# Altium project HU_revB.PrjPcb (part 1 of 4)
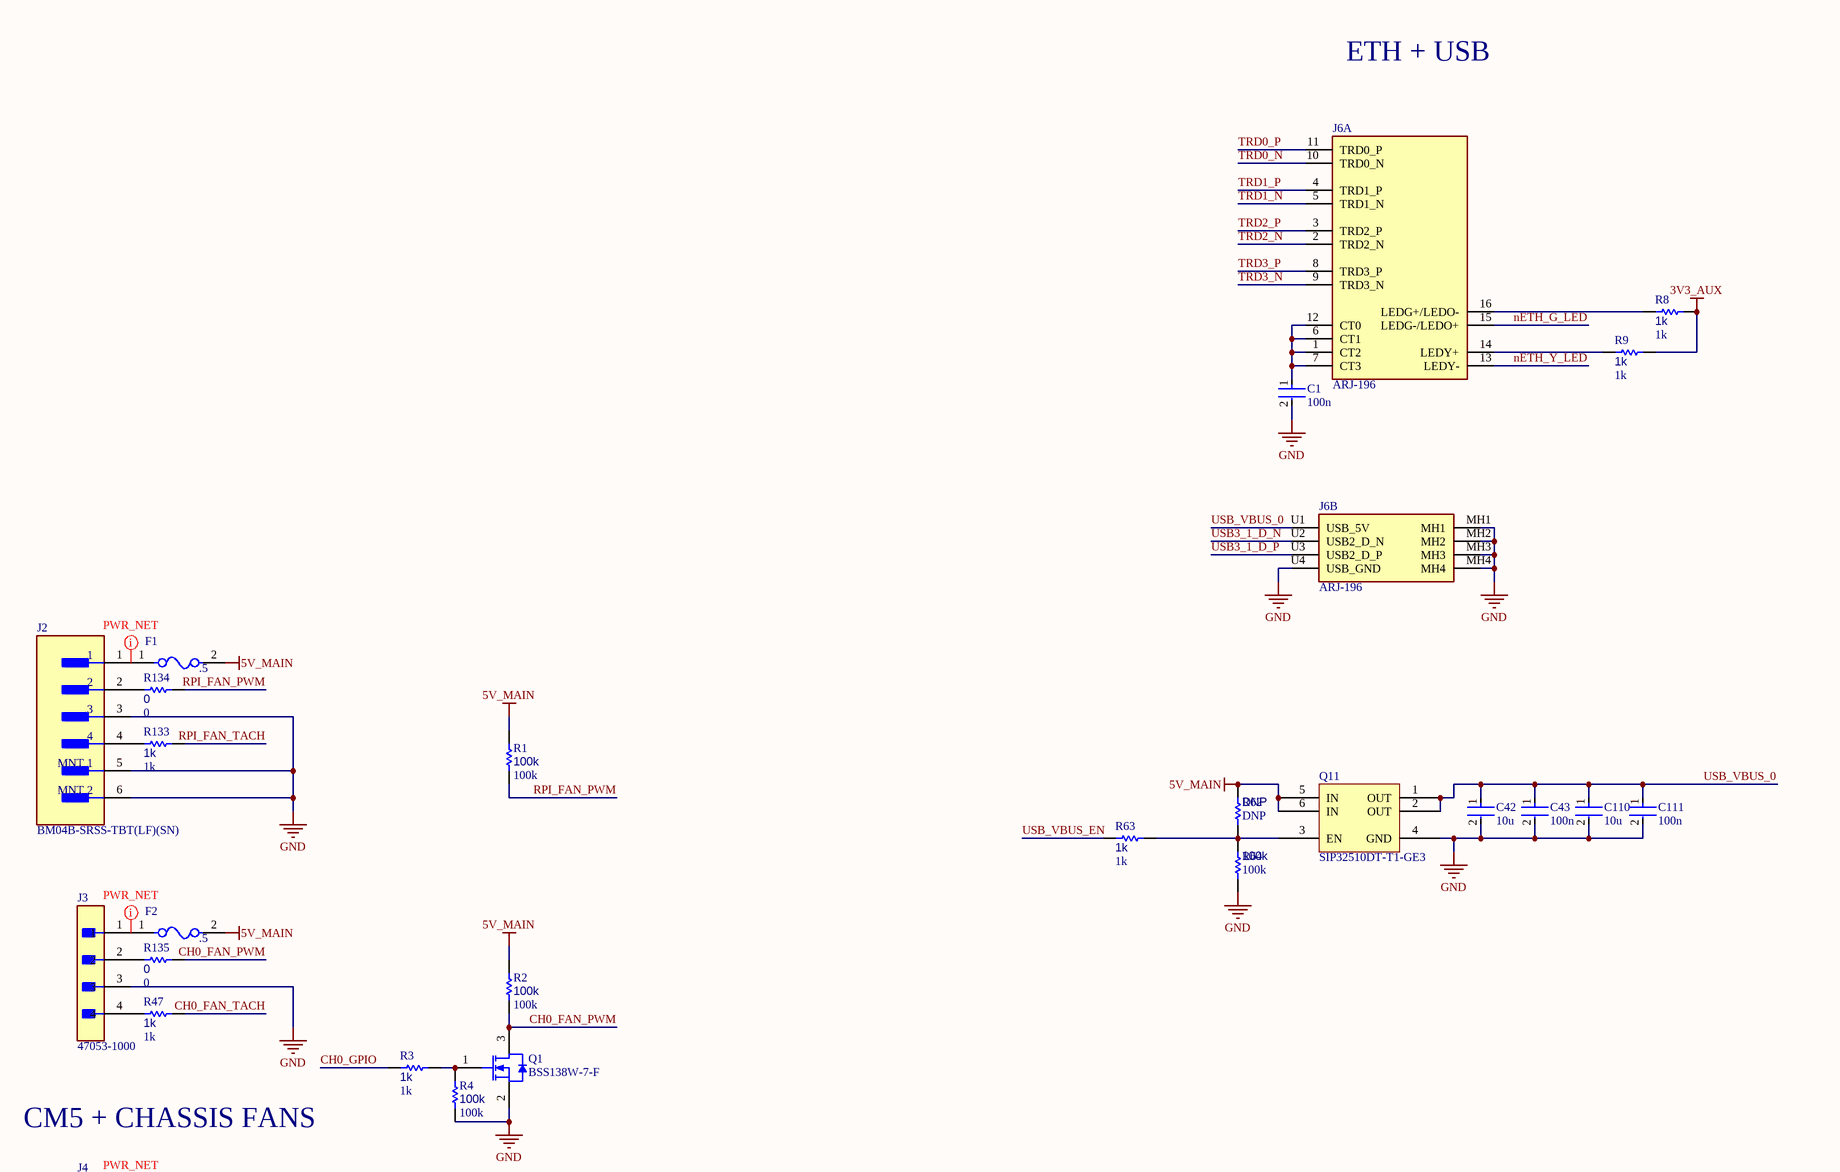
[diagram p0: HU_revB.SchDoc, top right]
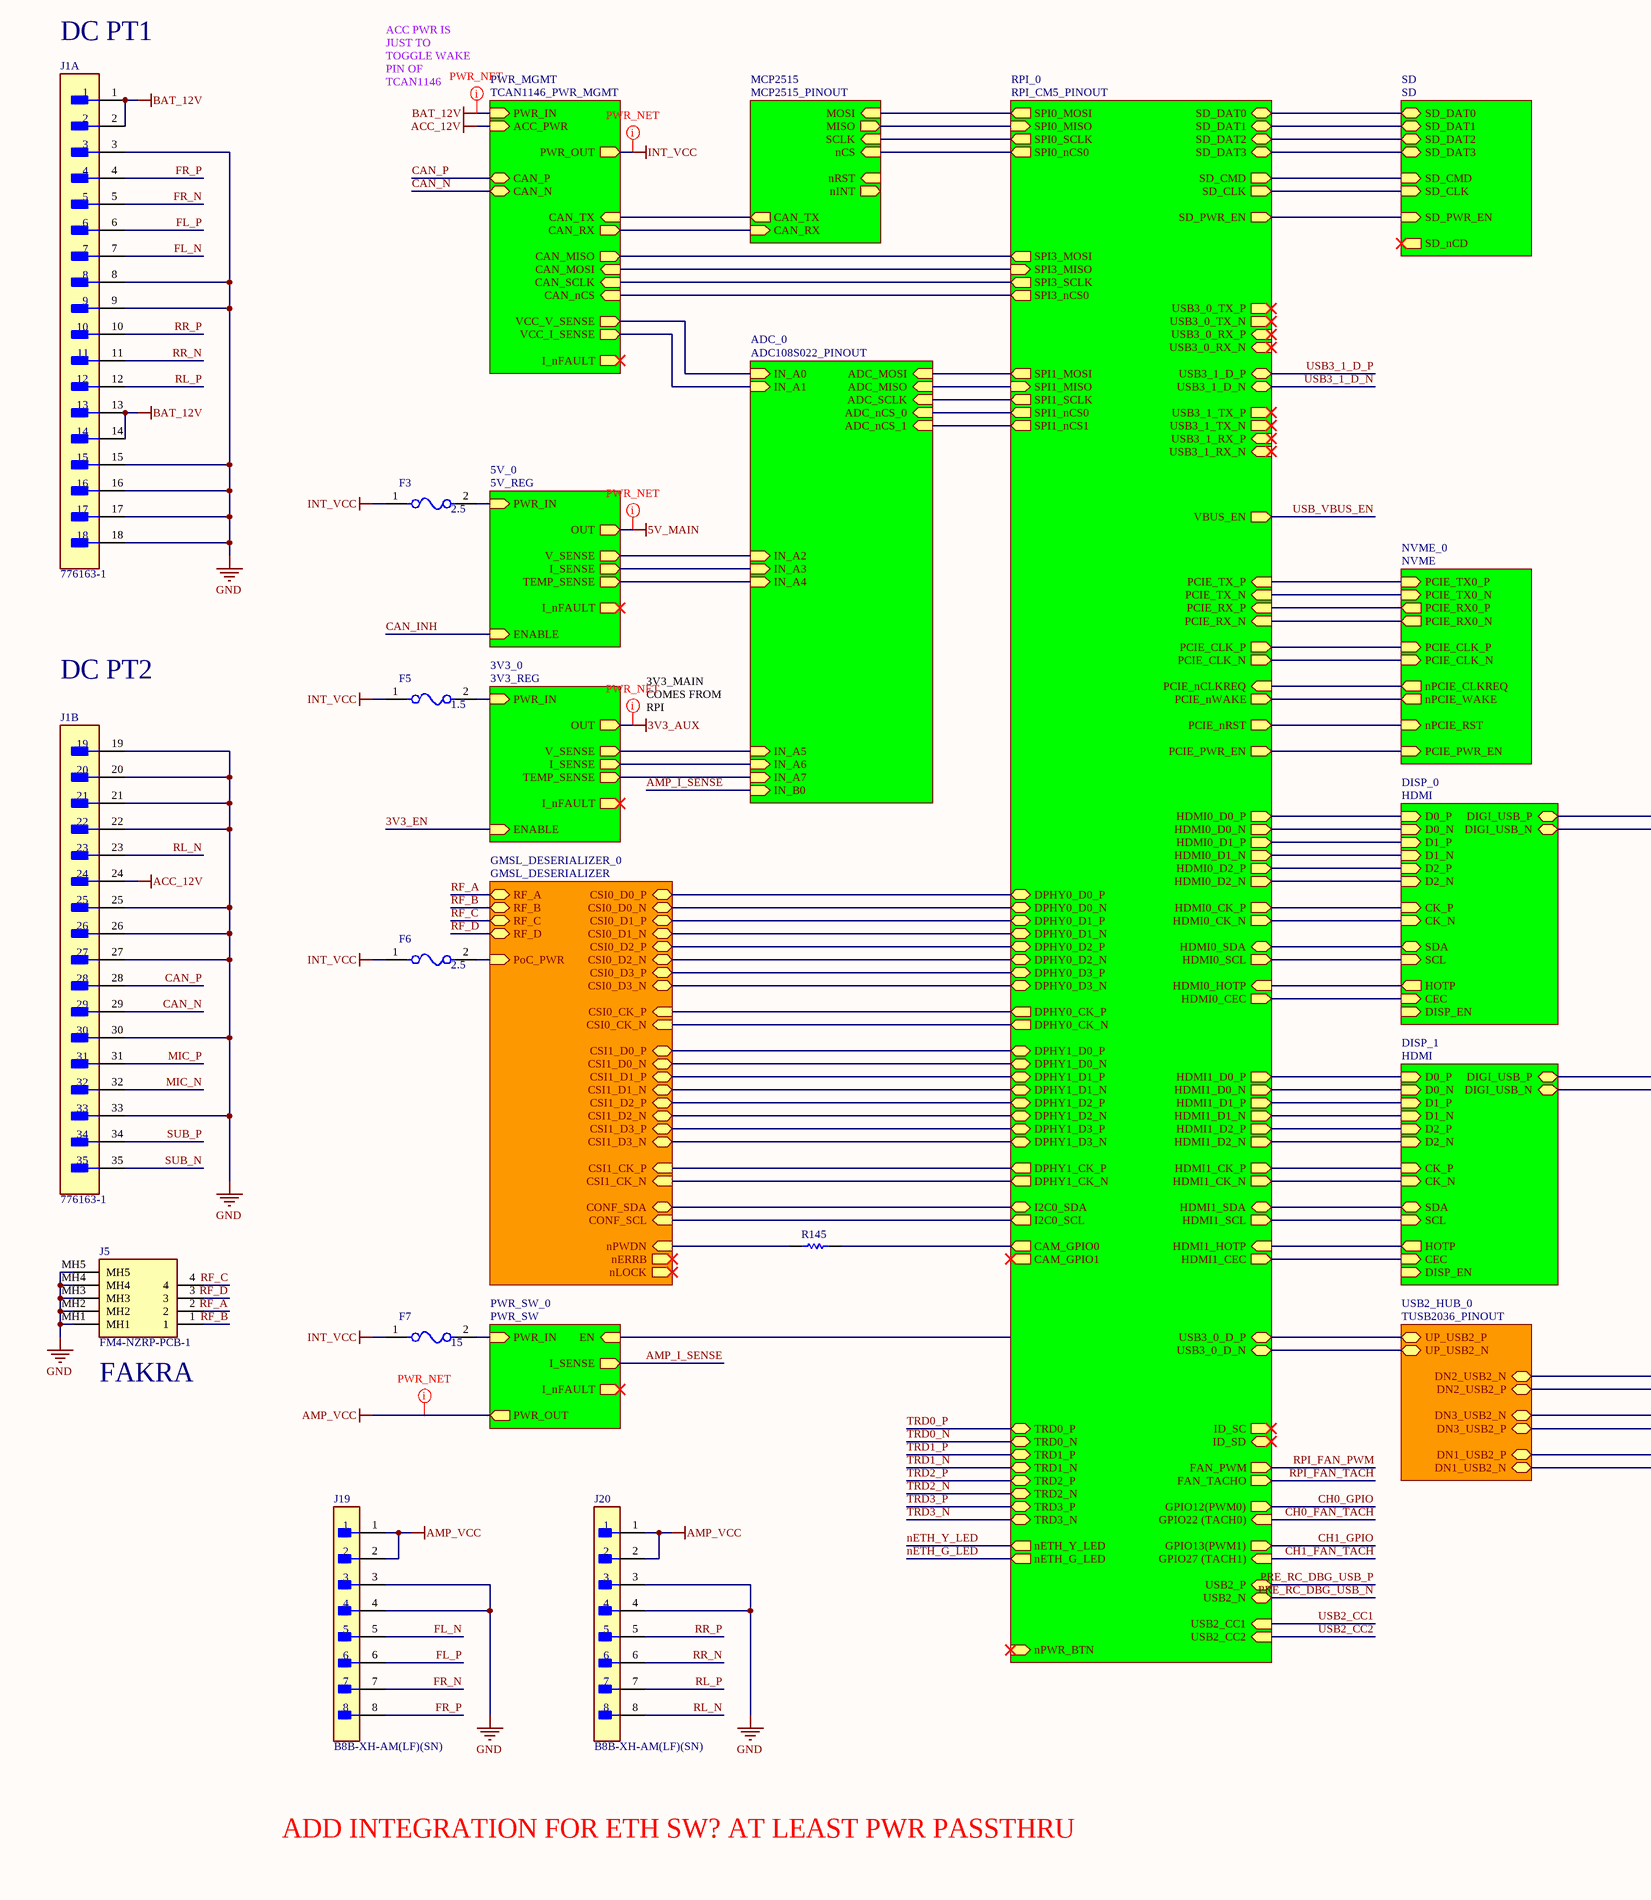
[diagram p1: HU_revB.SchDoc, bottom left]
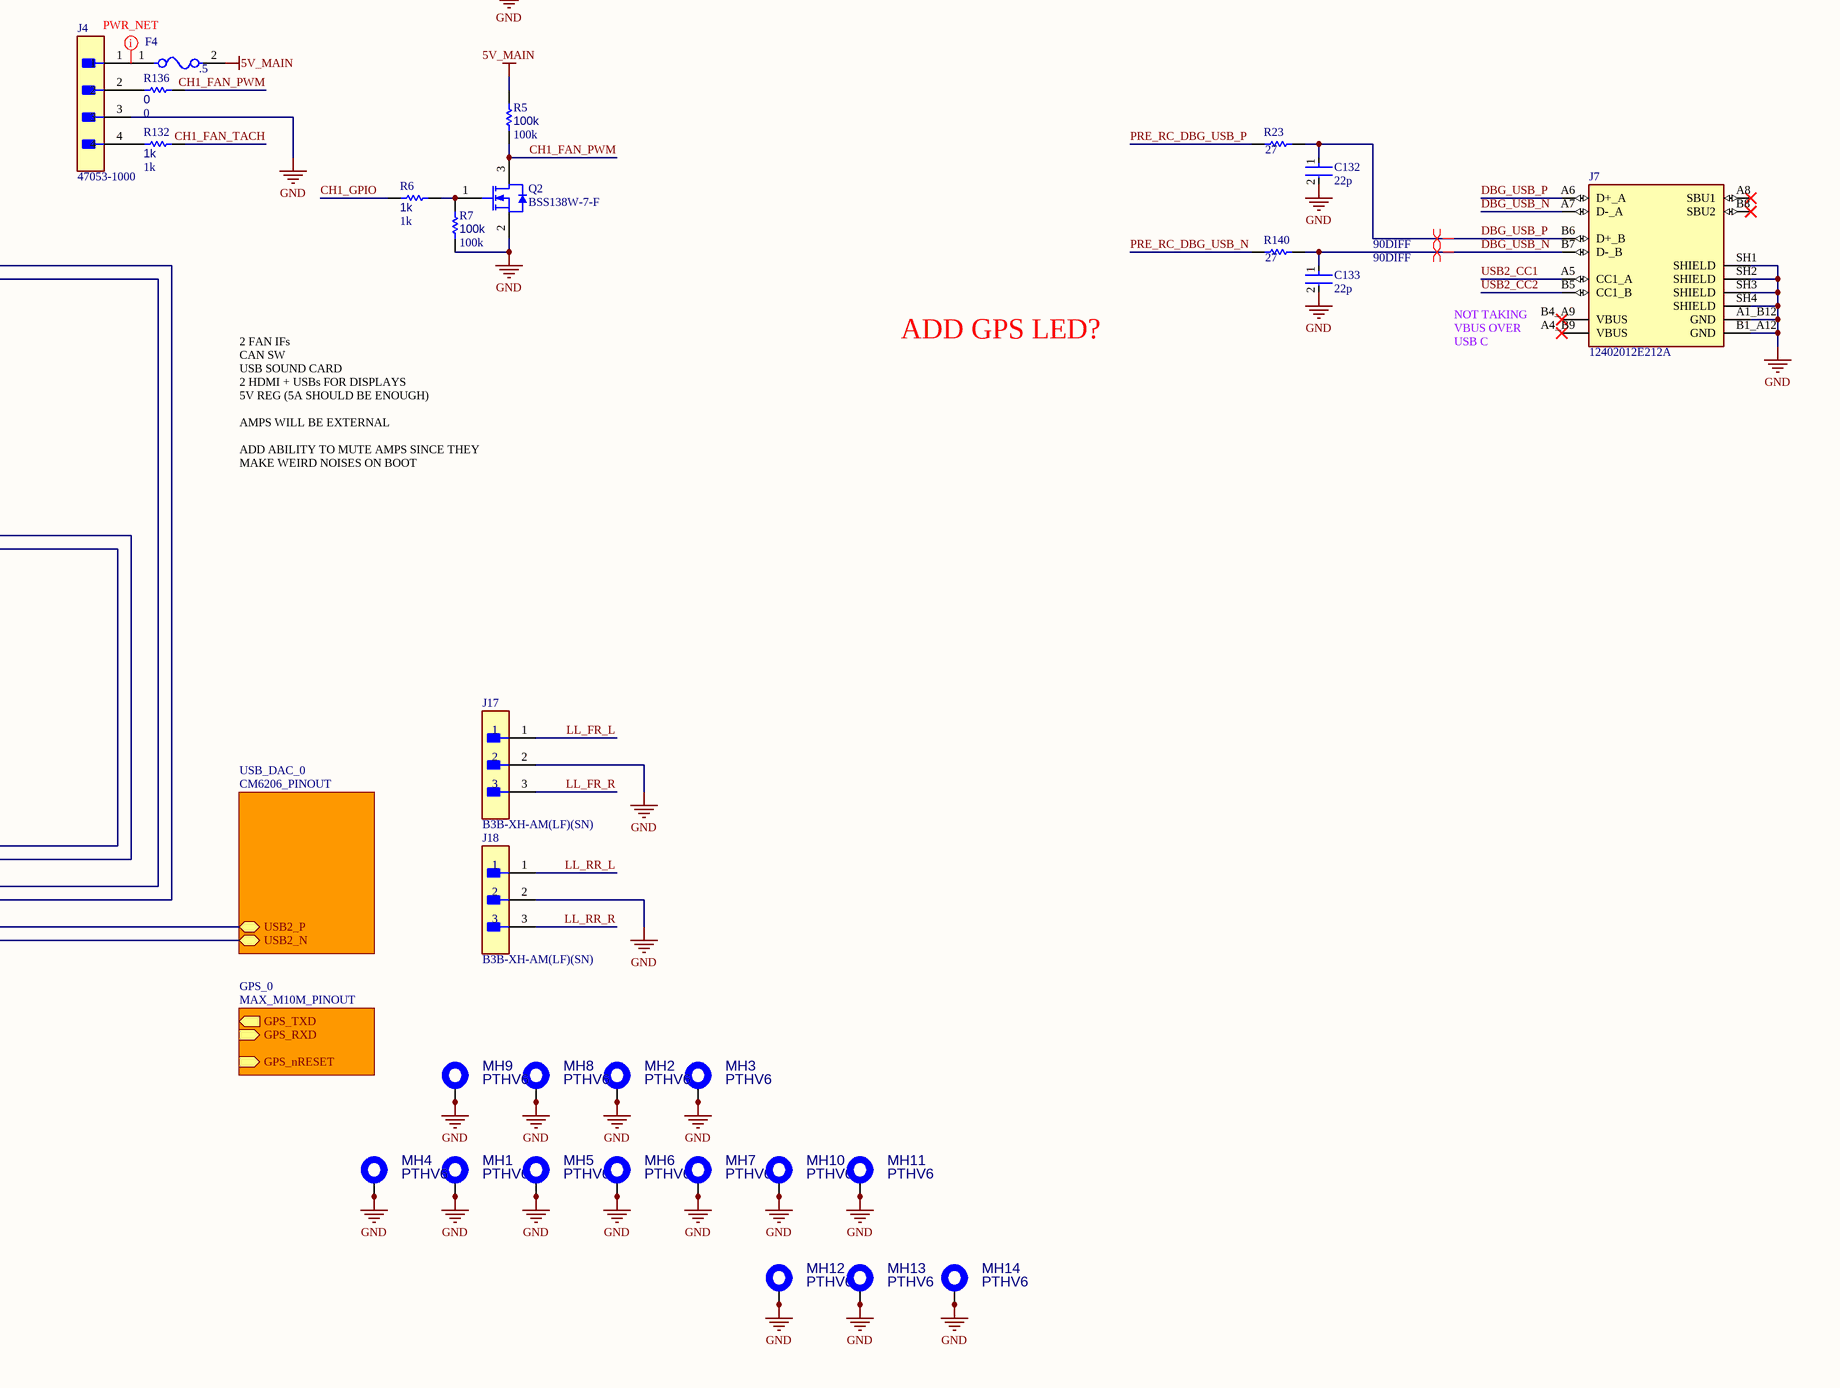
[diagram p2: HU_revB.SchDoc, bottom right]
16 sheets, 422 parts. Net scope: hierarchical (ports join the sheet entries above them; power ports are global).
Board file: HU_revB.PcbDoc
Sheets:
  HU_revB.SchDoc
    PWR_MGMT = TCAN1146_PWR_MGMT.SchDoc
    USB_DAC_0 = CM6206_PINOUT.SchDoc
    RPI_0 = RPI_CM5_PINOUT.SchDoc
    5V_0 = 5V_REG.SchDoc
    NVME_0 = NVME.SchDoc
    MCP2515 = MCP2515_PINOUT.SchDoc
    SD = SD.SchDoc
    DISP_0 = HDMI.SchDoc
    USB2_HUB_0 = TUSB2036_PINOUT.SchDoc
    DISP_1 = HDMI.SchDoc
    3V3_0 = 3V3_REG.SchDoc
    GMSL_DESERIALIZER_0 = GMSL_DESERIALIZER.SchDoc
    PWR_SW_0 = PWR_SW.SchDoc
    GPS_0 = MAX_M10M_PINOUT.SchDoc
  USB.SchDoc
  TS3USB221A_PINOUT.SchDoc

## Sheet HU_revB.SchDoc
size D; SheetNumber: 1; SheetTotal: 17

### Parts
(Parts that share a designator on the sheet are numbered #1, #2 ... from top to bottom, then left to right.)
C1  100n  [FP-0402-L_1_0_0_05-W_0_5-IPC_A]
C42#1  10u  [FP-0402-L_1_0_0_05-W_0_5-IPC_A]
C43#1  100n  [FP-0402-L_1_0_0_05-W_0_5-IPC_A]
C110  10u  [FP-0402-L_1_0_0_05-W_0_5-IPC_A]
C111  100n  [FP-0402-L_1_0_0_05-W_0_5-IPC_A]
C132  22p  [FP-0402-L_1_0_0_05-W_0_5-IPC_A]
C133  22p  [FP-0402-L_1_0_0_05-W_0_5-IPC_A]
F1  .5  [FP-0685T-MFG]
F2  .5  [FP-0685T-MFG]
F3  2.5  [FP-0685T-MFG]
F4  .5  [FP-0685T-MFG]
F5  1.5  [FP-0685T-MFG]
F6  2.5  [FP-0685T-MFG]
F7  15  [FP-0685T-MFG]
J1  776163-1  [FP-776163-1-MFG]  (parts A,B of 2)
J2  BM04B-SRSS-TBT(LF)(SN)  [FP-BM04B-SRSS-TBT_LF_SN-MFG]
J3  47053-1000  [FP-470531000-MFG]
J4  47053-1000  [FP-470531000-MFG]
J5  FM4-NZRP-PCB-1  [FM4-NZRP-PCB-1-Footprint-1]
J6  ARJ-196  [ARJ-196-Footprint-1]  (parts A,B of 2)
J7  12402012E212A  [12402012E212A-Footprint-1]
J17  B3B-XH-AM(LF)(SN)  [FP-B3B-XH-AM_LF_SN-MFG]
J18  B3B-XH-AM(LF)(SN)  [FP-B3B-XH-AM_LF_SN-MFG]
J19  B8B-XH-AM(LF)(SN)  [FP-B8B-XH-AM_LF_SN-MFG]
J20  B8B-XH-AM(LF)(SN)  [FP-B8B-XH-AM_LF_SN-MFG]
MH1  PTHV6  [PTHV6 M2]  (net tie, no BOM)
MH2  PTHV6  [PTHV6 M2]  (net tie, no BOM)
MH3  PTHV6  [PTHV6 M2]  (net tie, no BOM)
MH4  PTHV6  [PTHV6 M2]  (net tie, no BOM)
MH5  PTHV6  [PTHV6 M2]  (net tie, no BOM)
MH6  PTHV6  [PTHV6 M2]  (net tie, no BOM)
MH7  PTHV6  [PTHV6 M2]  (net tie, no BOM)
MH8  PTHV6  [PTHV6 M2]  (net tie, no BOM)
MH9  PTHV6  [PTHV6 M2]  (net tie, no BOM)
MH10  PTHV6  [PTHV6 M2]  (net tie, no BOM)
MH11  PTHV6  [PTHV6 M2]  (net tie, no BOM)
MH12  PTHV6  [PTHV6 M2]  (net tie, no BOM)
MH13  PTHV6  [PTHV6 M2]  (net tie, no BOM)
MH14  PTHV6  [PTHV6 M2]  (net tie, no BOM)
Q1  BSS138W-7-F  [DIOD-SOT323-3_V]
Q2  BSS138W-7-F  [DIOD-SOT323-3_V]
Q11#1  SIP32510DT-T1-GE3  [SOT95P284X110-6N]
R1  100k  [R0603B]
R2  100k  [R0603B]
R3  1k  [R0603B]
R4  100k  [R0603B]
R5  100k  [R0603B]
R6  1k  [R0603B]
R7  100k  [R0603B]
R8  1k  [R0603B]
R9  1k  [R0603B]
R23  27  [R0603B]
R47  1k  [R0603B]
R62#1  DNP  [R0603B]
R63#1  1k  [R0603B]
R64#1  100k  [R0603B]
R132  1k  [R0603B]
R133  1k  [R0603B]
R134  0  [R0603B]
R135  0  [R0603B]
R136  0  [R0603B]
R140  27  [R0603B]
R145  DNP  [RESC1005X40X25ML05T05]  (value not drawn)

### Sub-sheets
3V3_0 = 3V3_REG: PWR_IN (in), OUT (out), V_SENSE (out), I_SENSE (out), TEMP_SENSE (out), I_nFAULT (out), ENABLE (in)
5V_0 = 5V_REG: PWR_IN (in), OUT (out), V_SENSE (out), I_SENSE (out), TEMP_SENSE (out), I_nFAULT (out), ENABLE (in)
ADC_0 = ADC108S022_PINOUT (file not in this document): IN_A0 (in), IN_A1 (in), IN_A2 (in), IN_A3 (in), IN_A4 (in), IN_A5 (in), IN_A6 (in), IN_A7 (in), IN_B0 (in), ADC_MOSI (in), ADC_MISO (in), ADC_SCLK (in), ADC_nCS_0 (in), ADC_nCS_1 (in)
DISP_0 = HDMI: D0_N (in), D0_P (in), D2_P (in), D2_N (in), D1_P (in), D1_N (in), CK_P (in), CK_N (in), CEC (in), HOTP (out), SCL (in), SDA (bidir), DISP_EN (in), DIGI_USB_P (bidir), DIGI_USB_N (bidir)
DISP_1 = HDMI: D0_N (in), D0_P (in), D2_P (in), D2_N (in), D1_P (in), D1_N (in), CK_P (in), CK_N (in), CEC (in), HOTP (out), SCL (in), SDA (bidir), DISP_EN (in), DIGI_USB_P (bidir), DIGI_USB_N (bidir)
GMSL_DESERIALIZER_0 = GMSL_DESERIALIZER: CSI0_D0_P (bidir), CSI0_D0_N (bidir), CSI0_D1_P (bidir), CSI0_D1_N (bidir), CSI0_D2_P (bidir), CSI0_D2_N (bidir), CSI0_D3_P (bidir), CSI0_D3_N (bidir), CSI0_CK_P (in), CSI0_CK_N (in), CSI1_D0_P (bidir), CSI1_D0_N (bidir), CSI1_D1_P (bidir), CSI1_D1_N (bidir), CSI1_D2_P (bidir), CSI1_D2_N (bidir), CSI1_D3_P (bidir), CSI1_D3_N (bidir), CSI1_CK_P (in), CSI1_CK_N (in), RF_B (bidir), RF_A (bidir), RF_C (bidir), RF_D (bidir), CONF_SDA (bidir), CONF_SCL (in), nPWDN (in), PoC_PWR (in), nERRB (out), nLOCK (out)
GPS_0 = MAX_M10M_PINOUT: GPS_TXD (out), GPS_RXD (in), GPS_nRESET (in)
MCP2515 = MCP2515_PINOUT: MOSI (in), nCS (in), SCLK (in), MISO (out), nINT (out), nRST (in), CAN_RX (in), CAN_TX (out)
NVME_0 = NVME: nPCIE_RST (in), nPCIE_CLKREQ (out), nPCIE_WAKE (out), PCIE_PWR_EN (in), PCIE_TX0_N (in), PCIE_TX0_P (in), PCIE_RX0_N (out), PCIE_RX0_P (out), PCIE_CLK_N (in), PCIE_CLK_P (in)
PWR_MGMT = TCAN1146_PWR_MGMT: PWR_IN (in), PWR_OUT (out), CAN_P (bidir), CAN_N (bidir), CAN_TX (in), CAN_RX (out), CAN_SCLK (in), CAN_MISO (out), CAN_MOSI (in), CAN_nCS (in), VCC_V_SENSE (out), VCC_I_SENSE (out), I_nFAULT (out), ACC_PWR (in)
PWR_SW_0 = PWR_SW: PWR_IN (in), PWR_OUT (out), EN (in), I_SENSE (out), I_nFAULT (out)
RPI_0 = RPI_CM5_PINOUT: SD_CLK (out), SD_CMD (out), SD_DAT3 (bidir), SD_DAT0 (bidir), SD_DAT1 (bidir), SD_DAT2 (bidir), SD_PWR_EN (out), USB3_0_D_P (bidir), USB3_0_D_N (bidir), USB3_1_D_P (bidir), USB3_1_D_N (bidir), USB3_0_RX_N (in), USB3_0_RX_P (in), USB3_0_TX_N (out), USB3_0_TX_P (out), USB3_1_RX_N (in), USB3_1_RX_P (in), USB3_1_TX_N (out), USB3_1_TX_P (out), VBUS_EN (out), PCIE_nCLKREQ (in), PCIE_nWAKE (out), PCIE_PWR_EN (out), PCIE_CLK_P (out), PCIE_nRST (out), PCIE_CLK_N (out), PCIE_RX_P (in), PCIE_RX_N (in), PCIE_TX_P (in), PCIE_TX_N (in), HDMI1_HOTP (in), HDMI1_SDA (bidir), HDMI1_D2_P (out), HDMI1_D2_N (out), HDMI1_SCL (out), HDMI1_CEC (out), HDMI0_CEC (out), HDMI1_D1_P (out), HDMI1_D1_N (out), HDMI0_HOTP (in), HDMI1_D0_P (out), HDMI1_D0_N (out), HDMI1_CK_P (out), HDMI1_CK_N (out), HDMI0_D2_P (out), HDMI0_D2_N (out), HDMI0_D1_P (out), HDMI0_D1_N (out), HDMI0_D0_P (out), HDMI0_D0_N (out), HDMI0_CK_P (out), HDMI0_CK_N (out), HDMI0_SCL (out), HDMI0_SDA (bidir), USB2_N (bidir), USB2_P (bidir), DPHY0_D0_N (bidir), DPHY0_D0_P (bidir), DPHY0_D1_N (bidir), DPHY0_D1_P (bidir), DPHY0_D2_N (bidir), DPHY0_D2_P (bidir), DPHY0_D3_N (bidir), DPHY0_D3_P (bidir), DPHY0_CK_N (out), DPHY0_CK_P (out), DPHY1_D0_N (bidir), DPHY1_D0_P (bidir), DPHY1_D1_N (bidir), DPHY1_D1_P (bidir), DPHY1_D3_N (bidir), DPHY1_D2_N (bidir), DPHY1_D3_P (bidir), DPHY1_D2_P (bidir), DPHY1_CK_N (out), DPHY1_CK_P (out), TRD3_P (bidir), TRD1_P (bidir), TRD3_N (bidir), TRD1_N (bidir), TRD2_N (bidir), TRD0_N (bidir), TRD2_P (bidir), TRD0_P (bidir), nETH_Y_LED (out), nETH_G_LED (out), FAN_TACHO (out), FAN_PWM (out), SPI0_SCLK (out), SPI0_MISO (in), SPI0_nCS0 (out), SPI0_MOSI (out), SPI3_MOSI (out), SPI3_MISO (in), SPI3_SCLK (out), SPI3_nCS0 (out), SPI1_MISO (in), SPI1_MOSI (out), SPI1_nCS0 (out), SPI1_nCS1 (out), SPI1_SCLK (out), I2C0_SCL (out), I2C0_SDA (bidir), CAM_GPIO0 (out), CAM_GPIO1 (out), nPWR_BTN (in), GPIO12(PWM0) (out), GPIO13(PWM1) (out), GPIO22 (TACH0) (in), GPIO27 (TACH1) (in), ID_SC (out), ID_SD (bidir), USB2_CC1 (in), USB2_CC2 (in)
SD = SD: SD_DAT0 (bidir), SD_DAT1 (bidir), SD_DAT2 (bidir), SD_DAT3 (bidir), SD_CMD (in), SD_CLK (in), SD_PWR_EN (in), SD_nCD (out)
USB2_HUB_0 = TUSB2036_PINOUT: UP_USB2_N (bidir), UP_USB2_P (bidir), DN1_USB2_N (bidir), DN1_USB2_P (bidir), DN2_USB2_N (bidir), DN2_USB2_P (bidir), DN3_USB2_N (bidir), DN3_USB2_P (bidir)
USB_DAC_0 = CM6206_PINOUT: USB2_P (bidir), USB2_N (bidir)

### Nets
3V3_AUX: R8.1 R9.1 ; sheet 3V3_0/OUT
5V_MAIN: F1.2 F2.2 F4.2 Q11#1.5(IN) Q11#1.6(IN) R1.1 R2.1 R5.1 R62#1.2 ; sheet 5V_0/OUT
ACC_12V: J1.24 ; sheet PWR_MGMT/ACC_PWR
AMP_VCC: J19.1 J19.2 J20.1 J20.2 ; sheet PWR_SW_0/PWR_OUT
BAT_12V: J1.1 J1.2 J1.13 J1.14 ; sheet PWR_MGMT/PWR_IN
GND: C1.2 C42#1.2 C43#1.2 C110.2 C111.2 C132.2 C133.2 J1.3 J1.8 J1.9 J1.15 J1.16 J1.17 J1.18 J1.19 J1.20 J1.21 J1.22 J1.25 J1.26 J1.27 J1.30 J1.33 J2.3 J2.5(MNT_1) J2.6(MNT_2) J3.3 J4.3 J5.MH1 J5.MH2 J5.MH3 J5.MH4 J5.MH5 J6.MH1 J6.MH2 J6.MH3 J6.MH4 J6.U4(USB_GND) J7.A1_B12(GND) J7.B1_A12(GND) J7.SH1(SHIELD) J7.SH2(SHIELD) J7.SH3(SHIELD) J7.SH4(SHIELD) J17.2 J18.2 J19.3 J19.4 J20.3 J20.4 MH1.1(MH) MH1.2(V1) MH1.3(V2) MH1.4(V3) MH1.5(V4) MH1.6(V5) MH1.7(V6) MH2.1(MH) MH2.2(V1) MH2.3(V2) MH2.4(V3) MH2.5(V4) MH2.6(V5) MH2.7(V6) MH3.1(MH) MH3.2(V1) MH3.3(V2) MH3.4(V3) MH3.5(V4) MH3.6(V5) MH3.7(V6) MH4.1(MH) MH4.2(V1) MH4.3(V2) MH4.4(V3) MH4.5(V4) MH4.6(V5) MH4.7(V6) MH5.1(MH) MH5.2(V1) MH5.3(V2) MH5.4(V3) MH5.5(V4) MH5.6(V5) MH5.7(V6) MH6.1(MH) MH6.2(V1) MH6.3(V2) MH6.4(V3) MH6.5(V4) MH6.6(V5) MH6.7(V6) MH7.1(MH) MH7.2(V1) MH7.3(V2) MH7.4(V3) MH7.5(V4) MH7.6(V5) MH7.7(V6) MH8.1(MH) MH8.2(V1) MH8.3(V2) MH8.4(V3) MH8.5(V4) MH8.6(V5) MH8.7(V6) MH9.1(MH) MH9.2(V1) MH9.3(V2) MH9.4(V3) MH9.5(V4) MH9.6(V5) MH9.7(V6) MH10.1(MH) MH10.2(V1) MH10.3(V2) MH10.4(V3) MH10.5(V4) MH10.6(V5) MH10.7(V6) MH11.1(MH) MH11.2(V1) MH11.3(V2) MH11.4(V3) MH11.5(V4) MH11.6(V5) MH11.7(V6) MH12.1(MH) MH12.2(V1) MH12.3(V2) MH12.4(V3) MH12.5(V4) MH12.6(V5) MH12.7(V6) MH13.1(MH) MH13.2(V1) MH13.3(V2) MH13.4(V3) MH13.5(V4) MH13.6(V5) MH13.7(V6) MH14.1(MH) MH14.2(V1) MH14.3(V2) MH14.4(V3) MH14.5(V4) MH14.6(V5) MH14.7(V6) Q1.2(S) Q2.2(S) Q11#1.4(GND) R4.2 R7.2 R64#1.1
INT_VCC: F3.1 F5.1 F6.1 F7.1 ; sheet PWR_MGMT/PWR_OUT  [project net PWR_OUT]
AMP_I_SENSE: sheet ADC_0/IN_B0, sheet PWR_SW_0/I_SENSE
CAM_GPIO0: R145.1 ; sheet RPI_0/CAM_GPIO0
CAN_N: J1.29 ; sheet PWR_MGMT/CAN_N
CAN_P: J1.28 ; sheet PWR_MGMT/CAN_P
CH0_FAN_PWM: Q1.3(D) R2.2 R135.2
CH0_FAN_TACH: R47.2 ; sheet RPI_0/GPIO22 (TACH0)
CH0_GPIO: R3.1 ; sheet RPI_0/GPIO12(PWM0)
CH1_FAN_PWM: Q2.3(D) R5.2 R136.2
CH1_FAN_TACH: R132.2 ; sheet RPI_0/GPIO27 (TACH1)
CH1_GPIO: R6.1 ; sheet RPI_0/GPIO13(PWM1)
CONF_SCL: sheet RPI_0/I2C0_SCL, sheet GMSL_DESERIALIZER_0/CONF_SCL
CONF_SDA: sheet RPI_0/I2C0_SDA, sheet GMSL_DESERIALIZER_0/CONF_SDA
DBG_USB_N: C133.1 J7.A7(D-_A) J7.B7(D-_B) R140.1
DBG_USB_P: C132.1 J7.A6(D+_A) J7.B6(D+_B) R23.1
DIGI_USB_N: sheet DISP_0/DIGI_USB_N, sheet USB2_HUB_0/DN3_USB2_N
DIGI_USB_N: sheet USB2_HUB_0/DN2_USB2_N, sheet DISP_1/DIGI_USB_N  [a separate net that carries the same name]
DIGI_USB_P: sheet DISP_0/DIGI_USB_P, sheet USB2_HUB_0/DN3_USB2_P
DIGI_USB_P: sheet USB2_HUB_0/DN2_USB2_P, sheet DISP_1/DIGI_USB_P  [a separate net that carries the same name]
DPHY0_CK_N: sheet RPI_0/DPHY0_CK_N, sheet GMSL_DESERIALIZER_0/CSI0_CK_N
DPHY0_CK_P: sheet RPI_0/DPHY0_CK_P, sheet GMSL_DESERIALIZER_0/CSI0_CK_P
DPHY0_D0_N: sheet RPI_0/DPHY0_D0_N, sheet GMSL_DESERIALIZER_0/CSI0_D0_N
DPHY0_D0_P: sheet RPI_0/DPHY0_D0_P, sheet GMSL_DESERIALIZER_0/CSI0_D0_P
DPHY0_D1_N: sheet RPI_0/DPHY0_D1_N, sheet GMSL_DESERIALIZER_0/CSI0_D1_N
DPHY0_D1_P: sheet RPI_0/DPHY0_D1_P, sheet GMSL_DESERIALIZER_0/CSI0_D1_P
DPHY0_D2_N: sheet RPI_0/DPHY0_D2_N, sheet GMSL_DESERIALIZER_0/CSI0_D2_N
DPHY0_D2_P: sheet RPI_0/DPHY0_D2_P, sheet GMSL_DESERIALIZER_0/CSI0_D2_P
DPHY0_D3_N: sheet RPI_0/DPHY0_D3_N, sheet GMSL_DESERIALIZER_0/CSI0_D3_N
DPHY0_D3_P: sheet RPI_0/DPHY0_D3_P, sheet GMSL_DESERIALIZER_0/CSI0_D3_P
DPHY1_CK_N: sheet RPI_0/DPHY1_CK_N, sheet GMSL_DESERIALIZER_0/CSI1_CK_N
DPHY1_CK_P: sheet RPI_0/DPHY1_CK_P, sheet GMSL_DESERIALIZER_0/CSI1_CK_P
DPHY1_D0_N: sheet RPI_0/DPHY1_D0_N, sheet GMSL_DESERIALIZER_0/CSI1_D0_N
DPHY1_D0_P: sheet RPI_0/DPHY1_D0_P, sheet GMSL_DESERIALIZER_0/CSI1_D0_P
DPHY1_D1_N: sheet RPI_0/DPHY1_D1_N, sheet GMSL_DESERIALIZER_0/CSI1_D1_N
DPHY1_D1_P: sheet RPI_0/DPHY1_D1_P, sheet GMSL_DESERIALIZER_0/CSI1_D1_P
DPHY1_D2_N: sheet RPI_0/DPHY1_D2_N, sheet GMSL_DESERIALIZER_0/CSI1_D2_N
DPHY1_D2_P: sheet RPI_0/DPHY1_D2_P, sheet GMSL_DESERIALIZER_0/CSI1_D2_P
DPHY1_D3_N: sheet RPI_0/DPHY1_D3_N, sheet GMSL_DESERIALIZER_0/CSI1_D3_N
DPHY1_D3_P: sheet RPI_0/DPHY1_D3_P, sheet GMSL_DESERIALIZER_0/CSI1_D3_P
FL_N: J1.7 J19.5
FL_P: J1.6 J19.6
FR_N: J1.5 J19.7
FR_P: J1.4 J19.8
HDMI0_CEC: sheet RPI_0/HDMI0_CEC, sheet DISP_0/CEC
HDMI0_CK_N: sheet RPI_0/HDMI0_CK_N, sheet DISP_0/CK_N
HDMI0_CK_P: sheet RPI_0/HDMI0_CK_P, sheet DISP_0/CK_P
HDMI0_D0_N: sheet RPI_0/HDMI0_D0_N, sheet DISP_0/D0_N
HDMI0_D0_P: sheet RPI_0/HDMI0_D0_P, sheet DISP_0/D0_P
HDMI0_D1_N: sheet RPI_0/HDMI0_D1_N, sheet DISP_0/D1_N
HDMI0_D1_P: sheet RPI_0/HDMI0_D1_P, sheet DISP_0/D1_P
HDMI0_D2_N: sheet RPI_0/HDMI0_D2_N, sheet DISP_0/D2_N
HDMI0_D2_P: sheet RPI_0/HDMI0_D2_P, sheet DISP_0/D2_P
HDMI0_HOTP: sheet RPI_0/HDMI0_HOTP, sheet DISP_0/HOTP
HDMI0_SCL: sheet RPI_0/HDMI0_SCL, sheet DISP_0/SCL
HDMI0_SDA: sheet RPI_0/HDMI0_SDA, sheet DISP_0/SDA
HDMI1_CEC: sheet RPI_0/HDMI1_CEC, sheet DISP_1/CEC
HDMI1_CK_N: sheet RPI_0/HDMI1_CK_N, sheet DISP_1/CK_N
HDMI1_CK_P: sheet RPI_0/HDMI1_CK_P, sheet DISP_1/CK_P
HDMI1_D0_N: sheet RPI_0/HDMI1_D0_N, sheet DISP_1/D0_N
HDMI1_D0_P: sheet RPI_0/HDMI1_D0_P, sheet DISP_1/D0_P
HDMI1_D1_N: sheet RPI_0/HDMI1_D1_N, sheet DISP_1/D1_N
HDMI1_D1_P: sheet RPI_0/HDMI1_D1_P, sheet DISP_1/D1_P
HDMI1_D2_N: sheet RPI_0/HDMI1_D2_N, sheet DISP_1/D2_N
HDMI1_D2_P: sheet RPI_0/HDMI1_D2_P, sheet DISP_1/D2_P
HDMI1_HOTP: sheet RPI_0/HDMI1_HOTP, sheet DISP_1/HOTP
HDMI1_SCL: sheet RPI_0/HDMI1_SCL, sheet DISP_1/SCL
HDMI1_SDA: sheet RPI_0/HDMI1_SDA, sheet DISP_1/SDA
LL_FR_L: J17.1
LL_FR_R: J17.3
LL_RR_L: J18.1
LL_RR_R: J18.3
MIC_N: J1.32
MIC_P: J1.31
nETH_G_LED: J6.15(LEDG-/LEDO+) ; sheet RPI_0/nETH_G_LED
nETH_Y_LED: J6.13(LEDY-) ; sheet RPI_0/nETH_Y_LED
nPWDN: R145.2 ; sheet GMSL_DESERIALIZER_0/nPWDN
PCIE_CLK_N: sheet RPI_0/PCIE_CLK_N, sheet NVME_0/PCIE_CLK_N
PCIE_CLK_P: sheet RPI_0/PCIE_CLK_P, sheet NVME_0/PCIE_CLK_P
PCIE_nCLKREQ: sheet RPI_0/PCIE_nCLKREQ, sheet NVME_0/nPCIE_CLKREQ
PCIE_nRST: sheet RPI_0/PCIE_nRST, sheet NVME_0/nPCIE_RST
PCIE_nWAKE: sheet RPI_0/PCIE_nWAKE, sheet NVME_0/nPCIE_WAKE
PCIE_PWR_EN: sheet RPI_0/PCIE_PWR_EN, sheet NVME_0/PCIE_PWR_EN
PCIE_RX0_N: sheet RPI_0/PCIE_RX_N, sheet NVME_0/PCIE_RX0_N
PCIE_RX0_P: sheet RPI_0/PCIE_RX_P, sheet NVME_0/PCIE_RX0_P
PCIE_TX0_N: sheet RPI_0/PCIE_TX_N, sheet NVME_0/PCIE_TX0_N
PCIE_TX0_P: sheet RPI_0/PCIE_TX_P, sheet NVME_0/PCIE_TX0_P
PRE_PoC_PWR: F6.2 ; sheet GMSL_DESERIALIZER_0/PoC_PWR
PRE_RC_DBG_USB_N: R140.2 ; sheet RPI_0/USB2_N
PRE_RC_DBG_USB_P: R23.2 ; sheet RPI_0/USB2_P
RF_A: J5.2 ; sheet GMSL_DESERIALIZER_0/RF_A  [project net PoC_A]
RF_B: J5.1 ; sheet GMSL_DESERIALIZER_0/RF_B  [project net PoC_B]
RF_C: J5.4 ; sheet GMSL_DESERIALIZER_0/RF_C  [project net PoC_C]
RF_D: J5.3 ; sheet GMSL_DESERIALIZER_0/RF_D  [project net PoC_D]
RL_N: J1.23 J20.8
RL_P: J1.12 J20.7
RPI_FAN_PWM: R1.2 R134.2 ; sheet RPI_0/FAN_PWM  [project net FAN_PWM]
RPI_FAN_TACH: R133.2 ; sheet RPI_0/FAN_TACHO  [project net FAN_TACHO]
RR_N: J1.11 J20.6
RR_P: J1.10 J20.5
SD_CLK: sheet RPI_0/SD_CLK, sheet SD/SD_CLK
SD_CMD: sheet RPI_0/SD_CMD, sheet SD/SD_CMD
SD_DAT0: sheet RPI_0/SD_DAT0, sheet SD/SD_DAT0
SD_DAT1: sheet RPI_0/SD_DAT1, sheet SD/SD_DAT1
SD_DAT2: sheet RPI_0/SD_DAT2, sheet SD/SD_DAT2
SD_DAT3: sheet RPI_0/SD_DAT3, sheet SD/SD_DAT3
SD_PWR_EN: sheet RPI_0/SD_PWR_EN, sheet SD/SD_PWR_EN
SPI0_MISO: sheet RPI_0/SPI0_MISO, sheet MCP2515/MISO
SPI0_MOSI: sheet RPI_0/SPI0_MOSI, sheet MCP2515/MOSI
SPI0_nCS0: sheet RPI_0/SPI0_nCS0, sheet MCP2515/nCS
SPI0_SCLK: sheet RPI_0/SPI0_SCLK, sheet MCP2515/SCLK
SPI1_MISO: sheet RPI_0/SPI1_MISO, sheet ADC_0/ADC_MISO
SPI1_MOSI: sheet RPI_0/SPI1_MOSI, sheet ADC_0/ADC_MOSI
SPI1_nCS0: sheet RPI_0/SPI1_nCS0, sheet ADC_0/ADC_nCS_0
SPI1_nCS1: sheet RPI_0/SPI1_nCS1, sheet ADC_0/ADC_nCS_1
SPI1_SCLK: sheet RPI_0/SPI1_SCLK, sheet ADC_0/ADC_SCLK
SPI3_MISO: sheet PWR_MGMT/CAN_MOSI, sheet RPI_0/SPI3_MISO
SPI3_MOSI: sheet PWR_MGMT/CAN_MISO, sheet RPI_0/SPI3_MOSI
SPI3_nCS0: sheet PWR_MGMT/CAN_nCS, sheet RPI_0/SPI3_nCS0
SPI3_SCLK: sheet PWR_MGMT/CAN_SCLK, sheet RPI_0/SPI3_SCLK
SUB_N: J1.35
SUB_P: J1.34
TRD0_N: J6.10(TRD0_N) ; sheet RPI_0/TRD0_N
TRD0_P: J6.11(TRD0_P) ; sheet RPI_0/TRD0_P
TRD1_N: J6.5(TRD1_N) ; sheet RPI_0/TRD1_N
TRD1_P: J6.4(TRD1_P) ; sheet RPI_0/TRD1_P
TRD2_N: J6.2(TRD2_N) ; sheet RPI_0/TRD2_N
TRD2_P: J6.3(TRD2_P) ; sheet RPI_0/TRD2_P
TRD3_N: J6.9(TRD3_N) ; sheet RPI_0/TRD3_N
TRD3_P: J6.8(TRD3_P) ; sheet RPI_0/TRD3_P
USB2_CC1: J7.A5(CC1_A) ; sheet RPI_0/USB2_CC1
USB2_CC2: J7.B5(CC1_B) ; sheet RPI_0/USB2_CC2
USB3_0_D_N: sheet RPI_0/USB3_0_D_N, sheet USB2_HUB_0/UP_USB2_N
USB3_0_D_P: sheet RPI_0/USB3_0_D_P, sheet USB2_HUB_0/UP_USB2_P
USB3_1_D_N: J6.U2(USB2_D_N) ; sheet RPI_0/USB3_1_D_N
USB3_1_D_P: J6.U3(USB2_D_P) ; sheet RPI_0/USB3_1_D_P
USB_VBUS_0: C42#1.1 C43#1.1 C110.1 C111.1 J6.U1(USB_5V) Q11#1.1(OUT) Q11#1.2(OUT)
USB_VBUS_EN: R63#1.2 ; sheet RPI_0/VBUS_EN
NetC1_1: C1.1 J6.1(CT2) J6.6(CT1) J6.7(CT3) J6.12(CT0)
NetC12_1: F3.2 ; sheet 5V_0/PWR_IN
NetC46_1: sheet USB_DAC_0/USB2_P, sheet USB2_HUB_0/DN1_USB2_P
NetC48_1: sheet USB_DAC_0/USB2_N, sheet USB2_HUB_0/DN1_USB2_N
NetC62_1: F5.2 ; sheet 3V3_0/PWR_IN
NetD2_1: sheet PWR_MGMT/VCC_V_SENSE, sheet ADC_0/IN_A0
NetF1_1: F1.1 J2.1
NetF2_1: F2.1 J3.1
NetF4_1: F4.1 J4.1
NetF7_2: F7.2 ; sheet PWR_SW_0/PWR_IN
NetJ2_2: J2.2 R134.1
NetJ2_4: J2.4 R133.1
NetJ3_2: J3.2 R135.1
NetJ3_4: J3.4 R47.1
NetJ4_2: J4.2 R136.1
NetJ4_4: J4.4 R132.1
NetJ6_14: J6.14(LEDY+) R9.2
NetJ6_16: J6.16(LEDG+/LEDO-) R8.2
NetQ1_1: Q1.1(G) R3.2 R4.1
NetQ2_1: Q2.1(G) R6.2 R7.1
NetQ11#1_3: Q11#1.3(EN) R62#1.1 R63#1.1 R64#1.2
NetR10_1: sheet PWR_MGMT/VCC_I_SENSE, sheet ADC_0/IN_A1
NetR28_2: sheet 5V_0/TEMP_SENSE, sheet ADC_0/IN_A4
NetR32_1: sheet 5V_0/I_SENSE, sheet ADC_0/IN_A3
NetR34_1: sheet 5V_0/V_SENSE, sheet ADC_0/IN_A2
NetR84_2: sheet ADC_0/IN_A7, sheet 3V3_0/TEMP_SENSE
NetR88_1: sheet ADC_0/IN_A6, sheet 3V3_0/I_SENSE
NetR90_1: sheet ADC_0/IN_A5, sheet 3V3_0/V_SENSE
NetU2_1: sheet PWR_MGMT/CAN_TX, sheet MCP2515/CAN_TX
NetU2_4: sheet PWR_MGMT/CAN_RX, sheet MCP2515/CAN_RX

Not connected (* = marked no-connect by the designer): J7 A4_B9(VBUS)* A8(SBU1)* B4_A9(VBUS)* B8(SBU2)*

### Layout directives
net class PWR: 3V3_AUX, 5V_MAIN, AMP_VCC, BAT_12V, NetF1_1, NetF2_1, NetF4_1, PWR_OUT
differential pair; differential pair class 90DIFF: DBG_USB_N, DBG_USB_P

### Notes on the sheet
- ETH + USB
- DC PT1
- ACC PWR IS JUST TO TOGGLE WAKE PIN OF TCAN1146
- CM5 + CHASSIS FANS
- DC PT2
- 3V3_MAIN COMES FROM RPI
- ADD GPS LED?
- NOT TAKING VBUS OVER USB C
- 2 FAN IFs
  CAN SW
  USB SOUND CARD
  2 HDMI + USBs FOR DISPLAYS
  5V REG (5A SHOULD BE ENOUGH)
  AMPS WILL BE EXTERNAL
  ADD ABILITY TO MUTE AMPS SINCE THEY MAKE WEIRD NOISES ON BOOT
- (near J5) FAKRA
- ADD INTEGRATION FOR ETH SW? AT LEAST PWR PASSTHRU

### Library data of the parts
C1 C42#1 C43#1 C110 C111 C132 C133 = CMP-001-00058-1: LARGE PADS, 0402 CAP, CHANGE COMMENT TO MATCH REAL P/N; Capacitor Type: Ceramic; Min Operating Temperature: -55°C; Mounting Technology: Surface Mount; Pins: 2; Case/Package: 0402; RoHS Compliant: Yes; Max Operating Temperature: 85°C
F1-F7 = CMP-16042-000006-1: FUSE BOARD MNT 5A 63VAC/VDC 1206; RoHS Compliant: Yes
J1 = CMP-03369-000154-1: CONN HEADER R/A 35POS 4MM; Primary Type: Rectangular; Circuit Application: Power; Tab Thickness: 1.3mm; Number of Signal Positions: 35; Shielding: Unshielded; Pitch: 0.157inch; Max Voltage Rating (AC): 250V; Connector System: Wire-to-Device; Insulation: Insulated; Current Rating: 17A; PCB Thickness: 0.062inch; PCB Mount Retention: With; Gender: Male; Connector Type: Male Pin; PCB Mount Alignment: Yes (With); Series: Ampseal; Depth: 37.9mm; Orientation: Right Angle; Length: 3.03inch; Termination: Solder; Radiation Hardening: No; Number of Rows: 3; Contact Plating: Tin; Lead Free: Lead Free; Flammability Rating: UL94 V-0; Contact Material: Brass; Number of Contacts: 35; ELV: Compliant; Max Operating Temperature: 221°C; Min Operating Temperature: -40°C; Package Quantity: 1; Mount: Through Hole; Contact Type: Male Pin; Housing Material: Thermoplastic; Number of Positions: 35; Packaging: Bulk; Row Spacing: 0.157inch; RoHS Compliant: Yes; Height: 32.1mm; Color: Black; Fastening Type: Ramp; Sealable: Yes (With); Width: 37.9mm
J2 = CMP-17439-000370-1: CONN HEADER SMD 4POS 1MM; Voltage Rating: 50V; Number of Positions: 4; Pitch: 0.039inch; Mated Stacking Heights: 4.9mm; Packaging: Cut Tape; Contact Material: Copper Alloy; Lead Free: Lead Free; Contact Type: Male Pin; Fastening Type: Pull; Connector Type: Header; Contact Finish - Mating: TIN; Series: SR; Number of Rows: 1; Contact Shape: Square; Package Quantity: 1; Color: Natural; Flammability Rating: UL94 V-0; Mount: Surface Mount; Insulation Color: Natural; Termination: Solder; Contact Plating: Tin; Insulation Material: Nylon
J3 J4 = CMP-04776-000290-2: CONN HEADER VERT 4POS 2.54MM; NexarPartId: 854935; Manufacturer Lifecycle Status: ACTIVE; Voltage Rating (DC): 250V; Gender: Male; Plating: Copper; Number of Positions: 4; Glow Wire Compliant: Non-compliant; Current Rating: 500mA; Max Operating Temperature: 75°C; Number of Rows: 1; REACH SVHC: Unknown; Ambient Temperature Range High: 105°C; Pitch: 2.54mm; Height: 7.7mm; Min Operating Temperature: 0°C; Packaging: Bulk; Contact Material: Brass, Copper; Contact Plating: Tin; Lead Pitch: 2.54mm; Voltage Rating: 250V; Termination: Through Hole; Radiation Hardening: No; Orientation: Vertical; Mount: Through Hole; Number of Pins: 4; Country of Origin: HK; Halogen Free: Low Halogen; Lifecycle Status: Production; Number of Circuits: 4; Schedule B: 8536694040, 8536694040; Housing Color: Beige; Housing Material: Nylon; Depth: 5.84mm; RoHS: Compliant; Length: 10.2mm; Number of Contacts: 4
J5 = CMP-002-00044-4: Connector RF Mini-FAKRA Plug 9GHz 50Ohm Solder Right Angle Through Hole; Source: fakra4ch.SchLib; Component Type: Standard; Pins: 9; Design Item ID: CMP-002-00085-1
J6 = CMP-002-00092-1: Modular Connectors / Ethernet Connectors CONN MAGJACK 1PORT 1000 BASE-T; Connector Type: RJ45, USB; Max Operating Temperature: 85°C; Mounting Technology: Through Hole; Min Operating Temperature: -40°C
J7 = CMP-002-00091-1: USB Connector, USB Type C, USB 2.0, Receptacle, 24 Ways, Surface Mount, Through Hole Mount; Pins: 24
J17 J18 = CMP-17438-000009-1: CONN HEADER VERT 3POS 2.5MM; Max Current Rating: 3A; Gender: Male; Max Voltage Rating (AC): 250V; Connector Type: Male Pin; Pitch: 0.098inch; Number of Positions: 3; Contact Resistance: 20mR; Termination: Press-Fit; Housing Color: White; Housing Material: Polyamide; Orientation: Straight; Contact Material: Brass; Contact Type: Male Pin; Color: Natural; Packaging: Bulk; Lead Free: Lead Free; Depth: 5.75mm; Number of Rows: 1; Contact Plating: Tin; Length: 9.9mm; Max Operating Temperature: 85°C; Series: XH; Min Operating Temperature: -25°C; Fastening Type: Detent; Mount: Through Hole
J19 J20 = CMP-17439-000637-1: CONN HEADER VERT 8POS 2.5MM; Voltage Rating: 250V; Mated Stacking Heights: 9.8mm; Number of Positions: 8; Mount: Through Hole; Packaging: Bulk; Pitch: 2.5mm; Insulation Color: Natural; Lead Free: Lead Free; Termination: Press-Fit; Connector Type: Header; Contact Finish - Mating: TIN; Color: Green; Contact Type: Male Pin; Contact Material: Brass; Flammability Rating: UL94 V-0; Fastening Type: Detent; Contact Shape: Square; Series: XH; Insulation Material: Nylon; Number of Rows: 1; Contact Plating: Tin
MH1-MH14 = CMP-00028-00001-11: Plated mounting hole with 6 peripheral vias. This is a generic symbol that groups all relevant footprints.
Q1 Q2 = CMP-2000-05968-1: N-Channel Enhancement Mode Mosfet, 50 V, 200 mA, -55 to 150 degC, 6-Pin SOT-323, RoHS, Tape and Reel; Typical Turn-Off Delay Time: 20ns; Number of Channels: 1Channel; Type: EnhancementModeFieldEffectTransistor; Brand: DiodesIncorporated; Vds - Drain-Source Breakdown Voltage: 75V; Vgs - Gate-Source Voltage: 20V; Rds On - Drain-Source Resistance: 1.4Ohms; Transistor Type: 1N-Channel; Configuration: Single; Unit Weight: 0.000212oz; Pd - Power Dissipation: 200mW; Id - Continuous Drain Current: 200mA; Forward Transconductance - Min: 0.1S; Manufacturer URL: http://www.diodes.com/; Series: BSS138; Package Description: 3-Pin Small Outline Transistor, Body 2 x 1.25 mm, Pitch 0.65 mm; Mounting Technology: SurfaceMount; Product Category: MOSFET; RoHS: True; Maximum Operating Temperature: +150C; Height: 1mm; Length: 2.2mm; Technology: Si; Width: 1.35mm; Datasheet URL: http://www.diodes.com/_files/datasheets/ds30206.pdf; Manufacturer: DiodesIncorporated; Package / Case: SOT-323-3; Typical Turn-On Delay Time: 20ns; Transistor Polarity: N-Channel; Factory Pack Quantity: 3000; Packaging: Reel; Product: MOSFETSmallSignal; Datasheet Version: Rev. 11-2, 09/2013; Package Reference: SOT323; Minimum Operating Temperature: -55C; Mounting Style: SMD/SMT; Channel Mode: Enhancement
Q11#1 = CMP-019-00054-1: Power Switch ICs – Power Distribution; VISHAY; SIP32510DT-T1-GE3; 1; 1; 5.5 V; SOT-23-6; Max Supply Voltage: 5.5V; Max Power Dissipation: 833mW; Min Supply Voltage: 1.2V; Case/Package: SOT-23-6; Mounting Technology: Surface Mount; Max Operating Temperature: 85°C; Min Operating Temperature: -40°C
R1-R9 R23 R47 R62#1 R63#1 R64#1 R132-R136 R140 = CMP-009-00002-14: Resistor
  R1 R2 R4 R5 R7 R64#1: Value: 100k
  R3 R6 R8 R9 R47 R63#1 R132 R133: Value: 1k
  R23 R140: Value: 27
  R62#1: Value: DNP
  R134-R136: Value: 0
R145 = CMP-009-00118-2: READ THE NAME; Pins: 2; Component Type: Standard; Design Item ID: CMP-009-00206-2; Source: 0402jump.SchLib

## Sheet TCAN1146_PWR_MGMT.SchDoc
size C; SheetNumber: 2; SheetTotal: 17
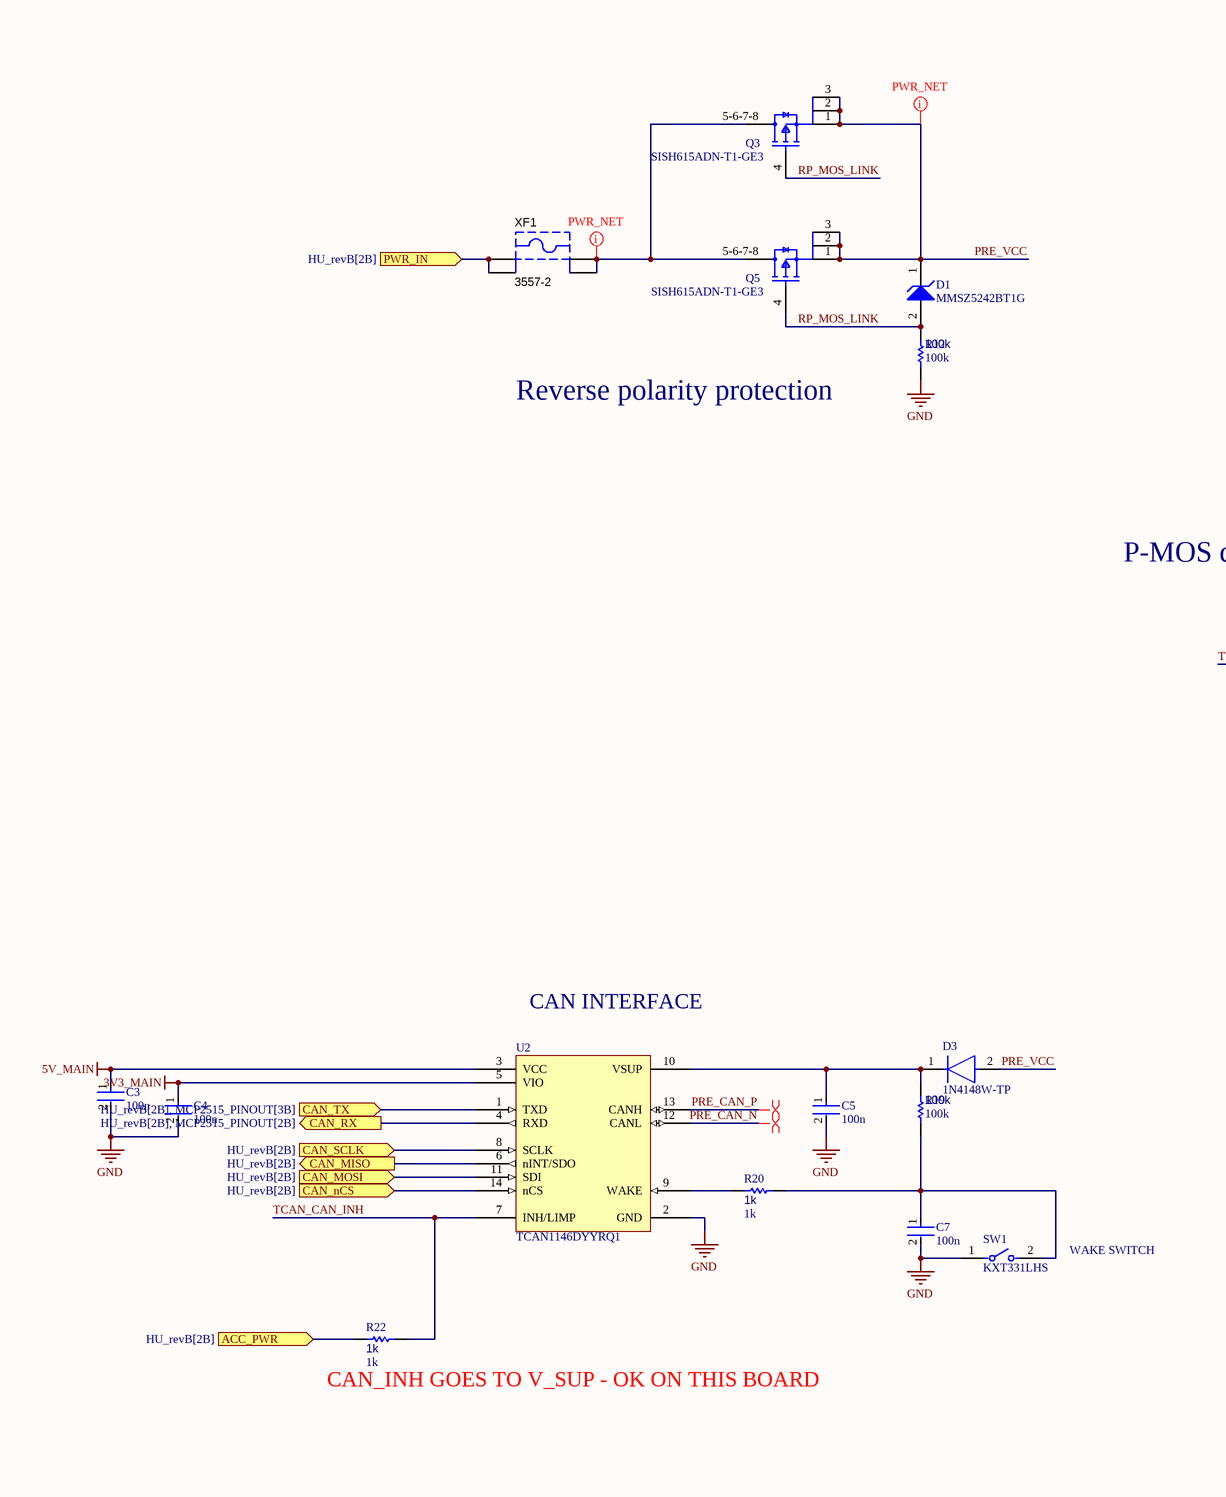
[diagram p3: TCAN1146_PWR_MGMT.SchDoc, left]
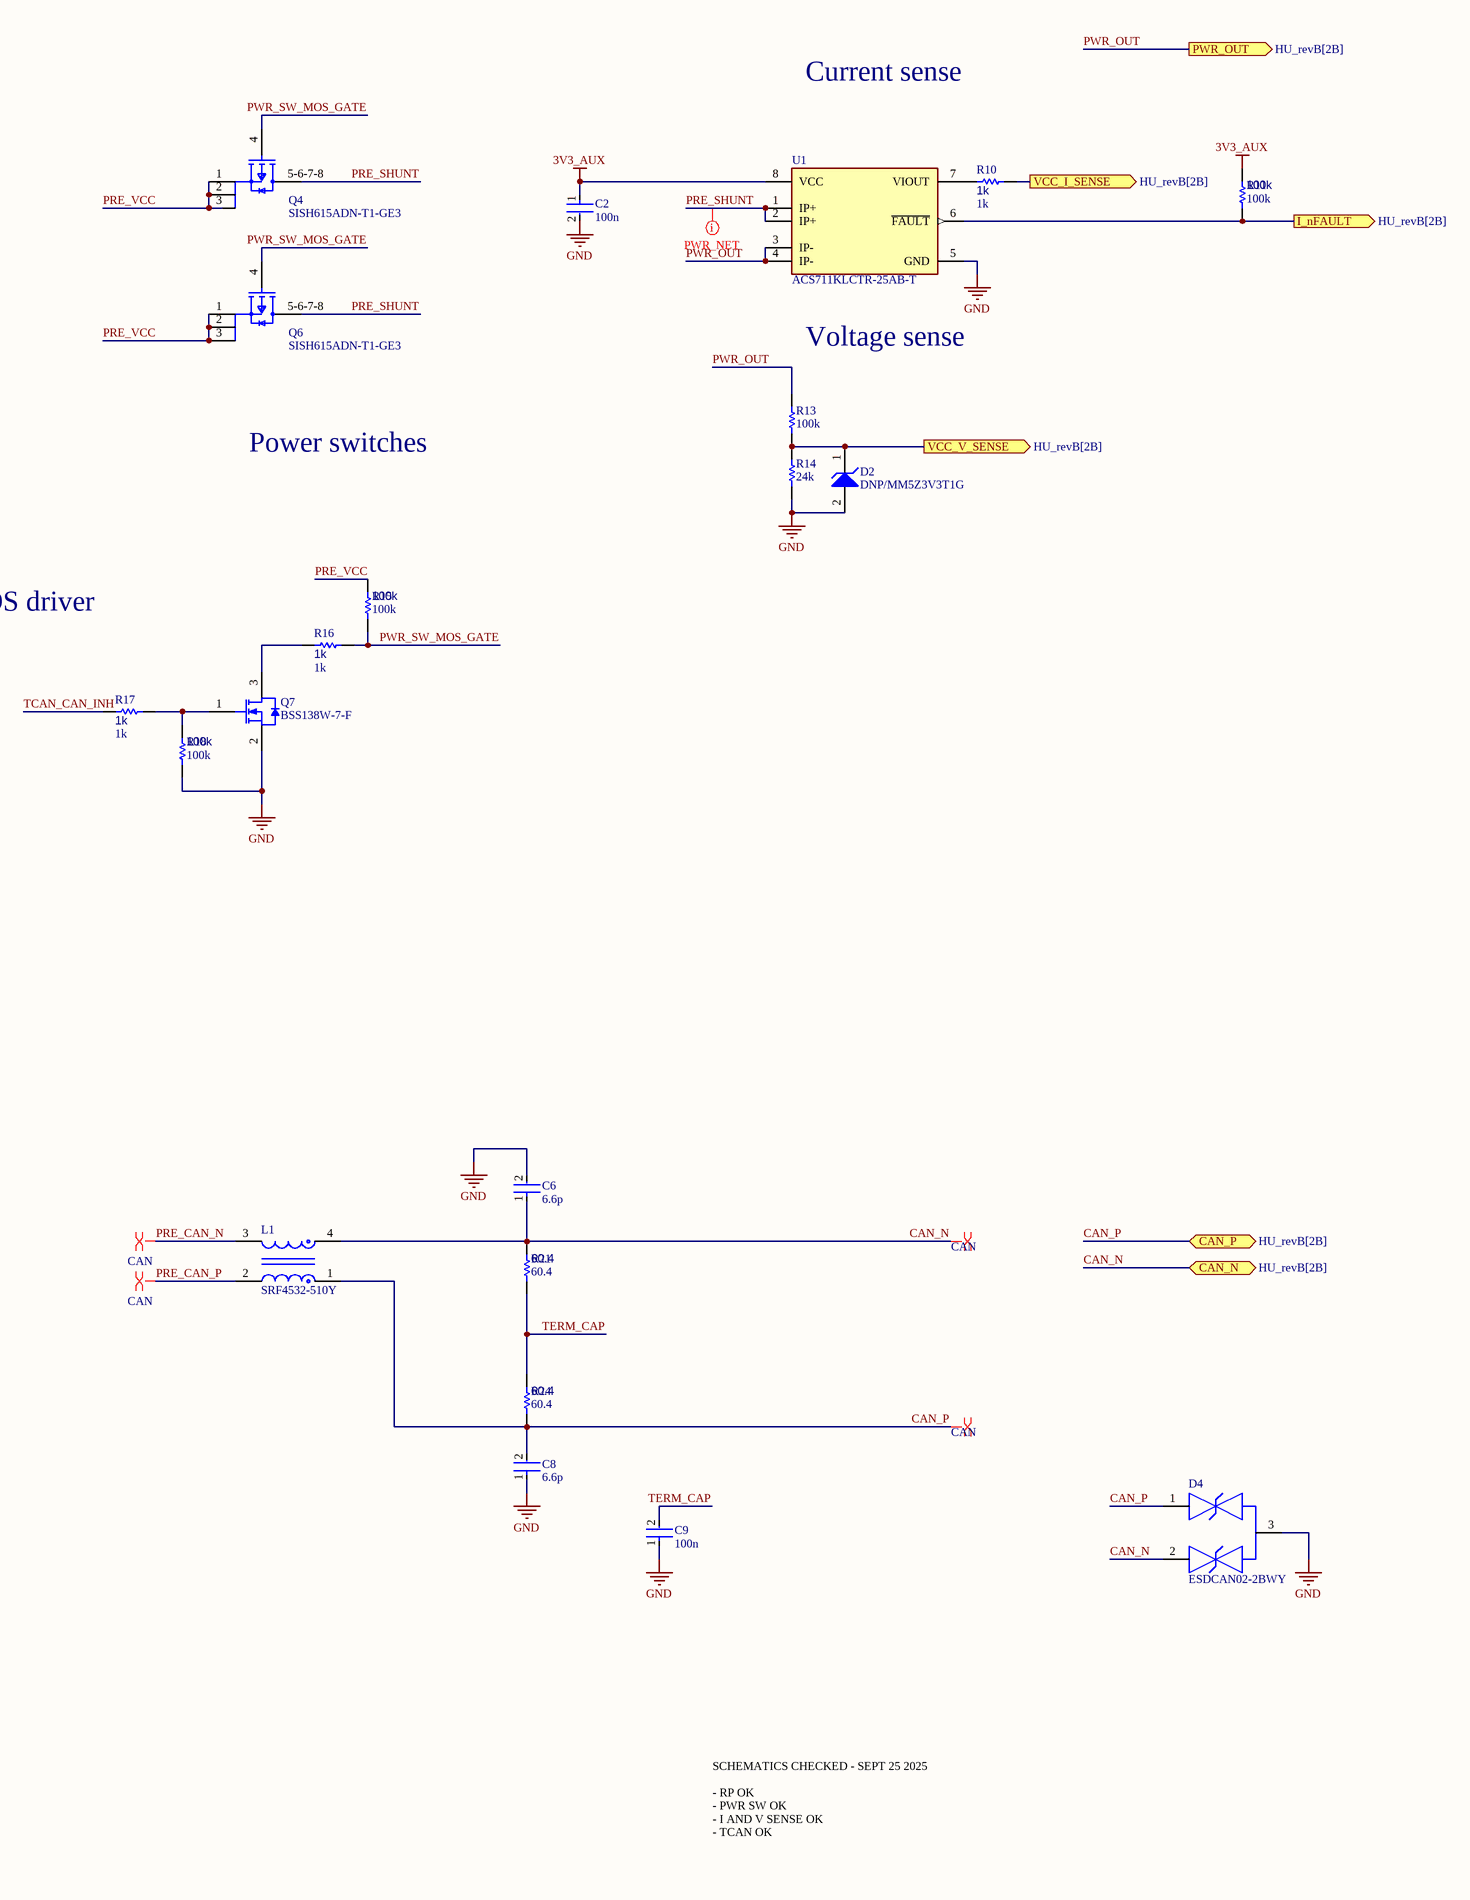
[diagram p4: TCAN1146_PWR_MGMT.SchDoc, right]

### Parts
C2  100n  [FP-0402-L_1_0_0_05-W_0_5-IPC_A]
C3  100n  [FP-0402-L_1_0_0_05-W_0_5-IPC_A]
C4  100n  [FP-0402-L_1_0_0_05-W_0_5-IPC_A]
C5  100n  [FP-0402-L_1_0_0_05-W_0_5-IPC_A]
C6  6.6p  [FP-0402-L_1_0_0_05-W_0_5-IPC_A]
C7  100n  [FP-0402-L_1_0_0_05-W_0_5-IPC_A]
C8  6.6p  [FP-0402-L_1_0_0_05-W_0_5-IPC_A]
C9  100n  [FP-0402-L_1_0_0_05-W_0_5-IPC_A]
D1  MMSZ5242BT1G  [ONSC-SOD-123-2-425-04_V]
D2  DNP/MM5Z3V3T1G  [ONSC-SOD-523-2-502-01_V]
D3  1N4148W-TP  [FP-SOD-123-IPC_A]
D4  ESDCAN02-2BWY  [FP-SOT323-3L-MFG]
L1  SRF4532-510Y  [FP-SRF4532-MFG]
Q3  SISH615ADN-T1-GE3  [SISH615ADN-T1-GE3-Footprint-1]
Q4  SISH615ADN-T1-GE3  [SISH615ADN-T1-GE3-Footprint-1]
Q5  SISH615ADN-T1-GE3  [SISH615ADN-T1-GE3-Footprint-1]
Q6  SISH615ADN-T1-GE3  [SISH615ADN-T1-GE3-Footprint-1]
Q7  BSS138W-7-F  [DIOD-SOT323-3_V]
R10  1k  [R0603B]
R11  100k  [R0603B]
R12  100k  [R0603B]
R13  100k  [R0603B]
R14  24k  [R0603B]
R15  100k  [R0603B]
R16  1k  [R0603B]
R17  1k  [R0603B]
R18  100k  [R0603B]
R19  100k  [R0603B]
R20  1k  [R0603B]
R21  60.4  [R0603B]
R22  1k  [R0603B]
R24  60.4  [R0603B]
SW1  KXT331LHS  [FP-KXT331LHS-MFG]
U1  ACS711KLCTR-25AB-T  [FP-LC-8-IPC_A]
U2  TCAN1146DYYRQ1  [TCAN1146DYYRQ1-Footprint-1]
XF1  3557-2  [KSTN-3557-2]

### Ports
ACC_PWR (in, see HU_revB[2B]), CAN_MISO (out, see HU_revB[2B]), CAN_MOSI (in, see HU_revB[2B]), CAN_N (bidir, see HU_revB[2B]), CAN_nCS (in, see HU_revB[2B]), CAN_P (bidir, see HU_revB[2B]), CAN_RX (out, see HU_revB[2B], MCP2515_PINOUT[2B]), CAN_SCLK (in, see HU_revB[2B]), CAN_TX (in, see HU_revB[2B], MCP2515_PINOUT[3B]), I_nFAULT (out, see HU_revB[2B]), PWR_IN (in, see HU_revB[2B]), PWR_OUT (out, see HU_revB[2B]), VCC_I_SENSE (out, see HU_revB[2B]), VCC_V_SENSE (out, see HU_revB[2B])

### Nets
3V3_AUX: C2.1 R11.2 U1.8(VCC)
3V3_MAIN: C4.1 U2.5(VIO)
5V_MAIN: C3.1 U2.3(VCC)
ACC_12V: R22.1 ; port ACC_PWR
BAT_12V: XF1.1 XF1.2 ; port PWR_IN
GND: C2.2 C3.2 C4.2 C5.2 C6.2 C7.2 C8.1 C9.1 D2.2(A) D4.3 Q7.2(S) R12.1 R14.1 R18.1 SW1.1 U1.5(GND) U2.2(GND)
PWR_OUT: R13.2 U1.3(IP-) U1.4(IP-) ; port PWR_OUT
CAN_N: C6.1 D4.2 L1.4 R21.2 ; port CAN_N
CAN_P: C8.2 D4.1 L1.1 R24.1 ; port CAN_P
PRE_CAN_N: L1.3 U2.12(CANL)
PRE_CAN_P: L1.2 U2.13(CANH)
PRE_SHUNT: Q4.5-6-7-8(D) Q6.5-6-7-8(D) U1.1(IP+) U1.2(IP+)
PRE_VCC: D1.1(K) D3.2(A) Q3.1(S) Q3.2(S) Q3.3(S) Q4.1(S) Q4.2(S) Q4.3(S) Q5.1(S) Q5.2(S) Q5.3(S) Q6.1(S) Q6.2(S) Q6.3(S) R15.2
PWR_SW_MOS_GATE: Q4.4(G) Q6.4(G) R15.1 R16.2
RP_MOS_LINK: D1.2(A) Q3.4(G) Q5.4(G) R12.2
SPI3_MISO: U2.11(SDI) ; port CAN_MOSI
SPI3_MOSI: U2.6(nINT/SDO) ; port CAN_MISO
SPI3_nCS0: U2.14(nCS) ; port CAN_nCS
SPI3_SCLK: U2.8(SCLK) ; port CAN_SCLK
TCAN_CAN_INH: R17.1 R22.2 U2.7(INH/LIMP)
TERM_CAP: C9.2 R21.1 R24.2
NetC5_1: C5.1 D3.1(C) R19.2 U2.10(VSUP)
NetC7_1: C7.1 R19.1 R20.2 SW1.2
NetD2_1: D2.1(K) R13.1 R14.2 ; port VCC_V_SENSE
NetQ3_5-6-7-8: Q3.5-6-7-8(D) Q5.5-6-7-8(D) XF1.3 XF1.4
NetQ7_1: Q7.1(G) R17.2 R18.2
NetQ7_3: Q7.3(D) R16.1
NetR10_1: R10.1 ; port VCC_I_SENSE
NetR10_2: R10.2 U1.7(VIOUT)
NetR11_1: R11.1 U1.6(~{FAULT}) ; port I_nFAULT
NetR20_1: R20.1 U2.9(WAKE)
NetU2_1: U2.1(TXD) ; port CAN_TX
NetU2_4: U2.4(RXD) ; port CAN_RX

### Layout directives
differential pair: PRE_CAN_N, PRE_CAN_P
differential pair; differential pair class CAN: CAN_N, CAN_P, PRE_CAN_N, PRE_CAN_P
net class PWR: NetQ3_5-6-7-8, PRE_SHUNT, PRE_VCC

### Notes on the sheet
- Current sense
- Voltage sense
- (near R12) Reverse polarity protection
- Power switches
- P-MOS driver
- CAN INTERFACE
- WAKE SWITCH
- (near R22) CAN_INH GOES TO V_SUP - OK ON THIS BOARD
- SCHEMATICS CHECKED - SEPT 25 2025
  - RP OK
  - PWR SW OK
  - I AND V SENSE OK
  - TCAN OK

### Library data of the parts
C2-C9 = CMP-001-00058-1: as C1 on sheet HU_revB; Min Operating Temperature: -55°C; Mounting Technology: Surface Mount; Pins: 2; Case/Package: 0402; RoHS Compliant: Yes; Max Operating Temperature: 85°C
D1 = CMP-1060-00565-1: Zener Voltage Regulator, 500 mW, 2-Pin SOD-123, Pb-Free, Tape and Reel; Manufacturer: On Semiconductor; P Max (W): 0.5; VZ Typ (V): 12; PartNumber: MMSZ5242BT1G; PackageReference: SOD-123-2-425-04; ComponentLink3URL: http://www.onsemi.com/pub_link/Collateral/425-04.PDF; Mounting Technology: Surface Mount; ComponentLink2Description: Datasheet; ComponentLink1URL: http://www.onsemi.com/; ComponentLink3Description: Package Specification; PackageDescription: 2-Pin SOD, Body 1.6 x 2.69 mm; PackageVersion: Rev. G, 10/2009; ComponentLink1Description: Manufacturer URL; RoHS: Pb-Free; ComponentLink2URL: http://www.onsemi.com/pub_link/Collateral/MMSZ5221BT1-D.PDF; Packing: Tape and Reel; DatasheetVersion: Rev. 12
D2 = CMP-1060-00750-1: Zener Voltage Regulator, 500 mW, 2-Pin SOD-523, Pb-Free, Tape and Reel; Manufacturer: On Semiconductor; P Max (W): 0.5; VZ Typ (V): 3.3; RoHS: Pb-Free; ComponentLink2Description: Datasheet; PackageReference: SOD-523-2-502-01; DatasheetVersion: Rev. 10; ComponentLink1Description: Manufacturer URL; PackageVersion: Rev. E, 09/2010; ComponentLink3URL: http://www.onsemi.com/pub_link/Collateral/502-01.PDF; ComponentLink2URL: http://www.onsemi.cn/pub_link/Collateral/MM5Z2V4T1-D.PDF; Mounting Technology: Surface Mount; PartNumber: MM5Z3V3T1G; Packing: Tape and Reel; PackageDescription: 2-Pin SOD, Body 1.2 x 0.8 mm; ComponentLink1URL: http://www.onsemi.com/; ComponentLink3Description: Package Specification
D3 = CMP-2000-04993-2: DIODE GEN PURP 100V 150MA SOD123; Max Reverse Leakage Current: 5uA; Max Surge Current: 2A; Reverse Recovery Time: 4ns; Polarity: Standard; Capacitance: 4pF; Max Forward Surge Current (Ifsm): 1A; Element Configuration: Single; Power Dissipation: 400mW; Forward Voltage: 1V; Radiation Hardening: No; Lead Free: Lead Free; Max Reverse Voltage (DC): 100V; Current Rating: 150mA; Forward Current: 150mA; Packaging: Tape and Reel; Number of Pins: 2; Package Quantity: 3000; Max Operating Temperature: 150°C; Min Operating Temperature: -65°C; Average Rectified Current: 150mA; Recovery Time: 4ns; Output Current: 150mA; Peak Non-Repetitive Surge Current: 2A; Width: 1.8mm; Voltage Rating (DC): 100V; Height: 1.2mm; Max Repetitive Reverse Voltage (Vrrm): 100V; Mount: Surface Mount; Length: 2.85mm
D4 = CMP-12225-000055-1: TVS DIODE 26.5V 44V SOT323-3; Manufacturer: STMicroelectronics; Value: 3pF; Direction: Bidirectional; Breakdown Voltage: 28.5V; Automotive Grade: Grade 0; Standoff Height: 0mm; Peak Pulse Power: 170W; Peak Pulse Current: 3A; Number Of Channels: 2; Max Junction Temp: +175°C; Mouser Description: TVS Diodes / ESD Suppressors Automotive dual-line Transil, Transient voltage suppressor (TVS) for CAN bus; Height: 1.1mm; Category: Diode; Reverse Standoff Voltage: 26.5V; Device Class L1: Circuit Protection; Temperature: -55°C to +175°C; RoHS: TRUE; ComponentLink2URL: https://www.st.com/resource/en/datasheet/esdcan02-2bwy.pdf; Device Class L3: unset; Device Class L2: TVS Diodes; Temperature Range High: +175°C; Octopart: https://octopart.com/esdcan02-2bwy-stmicroelectronics-58631133; Ipc Land Pattern Name: SOT65P210X95-3; Temperature Range Low: -55°C; Capacitance: 3pF; Digikey Description: TVS DIODE 26.5V 44V SOT323-3; Automotive: Yes; ComponentLink2Description: Datasheet; Clamping Voltage: 44V; Manufacturer Part Number: ESDCAN02-2BWY; Lead Free: Yes; Package: SOT323-3L
L1 = CMP-07251-000006-1: CMC 51UH 200MA 2LN 2KOHM SMD; Element Configuration: Dual; Number of Lines: 2; Core Material: Ferrite; Impedance: 2kR; Test Frequency: 100kHz; Voltage Rating (DC): 50V; Insulation Resistance: 10MR; Material: Steel; Tolerance: 50%; DC Resistance (DCR): 3.5R; RoHS Compliant: Yes; Mount: Surface Mount; REACH SVHC: No SVHC; Termination: SMD/SMT; DC Current: 200mA; Current: 200mA; Lead Free: Lead Free; Contact Plating: Tin; Length: 4.5mm; Max DC Current: 200mA; Width: 0.126inch; Case/Package: 4532; Packaging: Tape and Reel; Package Quantity: 1; Min Operating Temperature: -40°C; Depth: 3.4mm; Series: SRF4532; Max Operating Temperature: 125°C; Current Rating: 200mA; Self Resonant Frequency: 100kHz; Height: 0.118inch; Inductance: 51uH; Resistance: 2kR
Q3-Q6 = CMP-013-00018-2: Trans MOSFET P-CH 20V 22.1A 8-Pin PowerPAK 1212 EP T/R; Source: SISH615ADN-T1-GE3.SchLib; Design Item ID: CMP-013-00036-4; Component Type: Standard; Pins: 5
Q7 = CMP-2000-05968-1: as Q1 on sheet HU_revB; Manufacturer URL: http://www.diodes.com/; Series: BSS138; Package Description: 3-Pin Small Outline Transistor, Body 2 x 1.25 mm, Pitch 0.65 mm; Mounting Technology: SurfaceMount; Product Category: MOSFET; RoHS: True; Maximum Operating Temperature: +150C; Height: 1mm; Length: 2.2mm; Technology: Si; Width: 1.35mm; Datasheet URL: http://www.diodes.com/_files/datasheets/ds30206.pdf; Manufacturer: DiodesIncorporated; Package / Case: SOT-323-3; Typical Turn-On Delay Time: 20ns; Transistor Polarity: N-Channel; Factory Pack Quantity: 3000; Packaging: Reel; Product: MOSFETSmallSignal; Datasheet Version: Rev. 11-2, 09/2013; Package Reference: SOT323; Minimum Operating Temperature: -55C; Mounting Style: SMD/SMT; Channel Mode: Enhancement
R10-R22 R24 = CMP-009-00002-14: Resistor
  R10 R16 R17 R20 R22: Value: 1k
  R11-R13 R15 R18 R19: Value: 100k
  R14: Value: 24k
  R21 R24: Value: 60.4
SW1 = CMP-10040-000029-1: SWITCH TACTILE SPST-NO 0.02A 15V; Operating Force: 240gf; Switch Travel: 0.13mm; Illumination Type: Non-Illuminated; Throw Configuration: SPST; Number of Ports: 1; Current Rating: 5A; Mechanical Life: 500000Cycles; Switch Function: Off-Mom; Connector Type: USB; Actuator Type: Standard; Gender: Receptacle; Number of Contacts: 24; Contact Plating: Gold; Insulation Color: Black; Min Operating Temperature: -40°C; Packaging: Tape and Reel; Flammability Rating: UL94 V-0; Max Operating Temperature: 85°C; Termination: Solder; Mount: Surface Mount
U1 = CMP-1557-00015-2: SENSOR CURRENT HALL 25A AC/DC; Bandwidth: 100kHz; Min Supply Voltage: 3V; Polarity: Bidirectional; Max Supply Voltage: 5.5V; Max Supply Current: 5.5mA; Number of Channels: 1; Quiescent Current: 4mA; Sensitivity: 55mV/A; Accuracy: 4%; Linearity: 1%; Operating Supply Voltage: 3.3V; Response Time: 4.6us; Case/Package: SOIC; Min Operating Temperature: -40°C; RoHS Compliant: Yes; Length: 4.9mm; Package Quantity: 1; Number of Pins: 8; Width: 3.9mm; REACH SVHC: No SVHC; -3db Bandwidth: 100kHz; Series: -; Packaging: Tape and Reel; Max Operating Temperature: 125°C; Current Sensing: 25A; Height: 1.5mm; Frequency: 100kHz
U2 = CMP-318-000000-2: Automotive CAN FD transceiver with watchdog, bus diagnostics and partial networking via sele 14-SOT-23-THIN -40 to 150; Component Type: Standard; Design Item ID: CMP-015-00012-2; Pin Count: 14; Source: TCAN1146DYYRQ1.SchLib
XF1 = CMP-2000-05461-1: FUSE HOLDER, PCB MOUNT, 500VAC, 20A, ROHS; Manufacturer: Keystone-Electronics; Number of Circuits: 1; Voltage: 500V; Fuseholder Type: Block; Fuse Type: Blade; Fuse Size: 0.43"Lx0.15"Wx0.64"H(10.92mmx3.81mmx16.25mm); For Use With/Related Products: ATC,ATO257,MINI897; Current Rating: 30A; Datasheet URL: http://datasheet.octopart.com/3557-2-Keystone-datasheet-15715937.pdf; Orientation: Vertical; Family: Fuseholders; Datasheet Version: Apr-13; Contact Finish: TinNickel; Mounting Type: PCB; Series: -; Category: CircuitProtection; Termination Style: PCPin; Contact Material: Brass; Manufacturer URL: http://www.keyelco.com/

## Sheet CM6206_PINOUT.SchDoc
size C; SheetNumber: 3; SheetTotal: 16
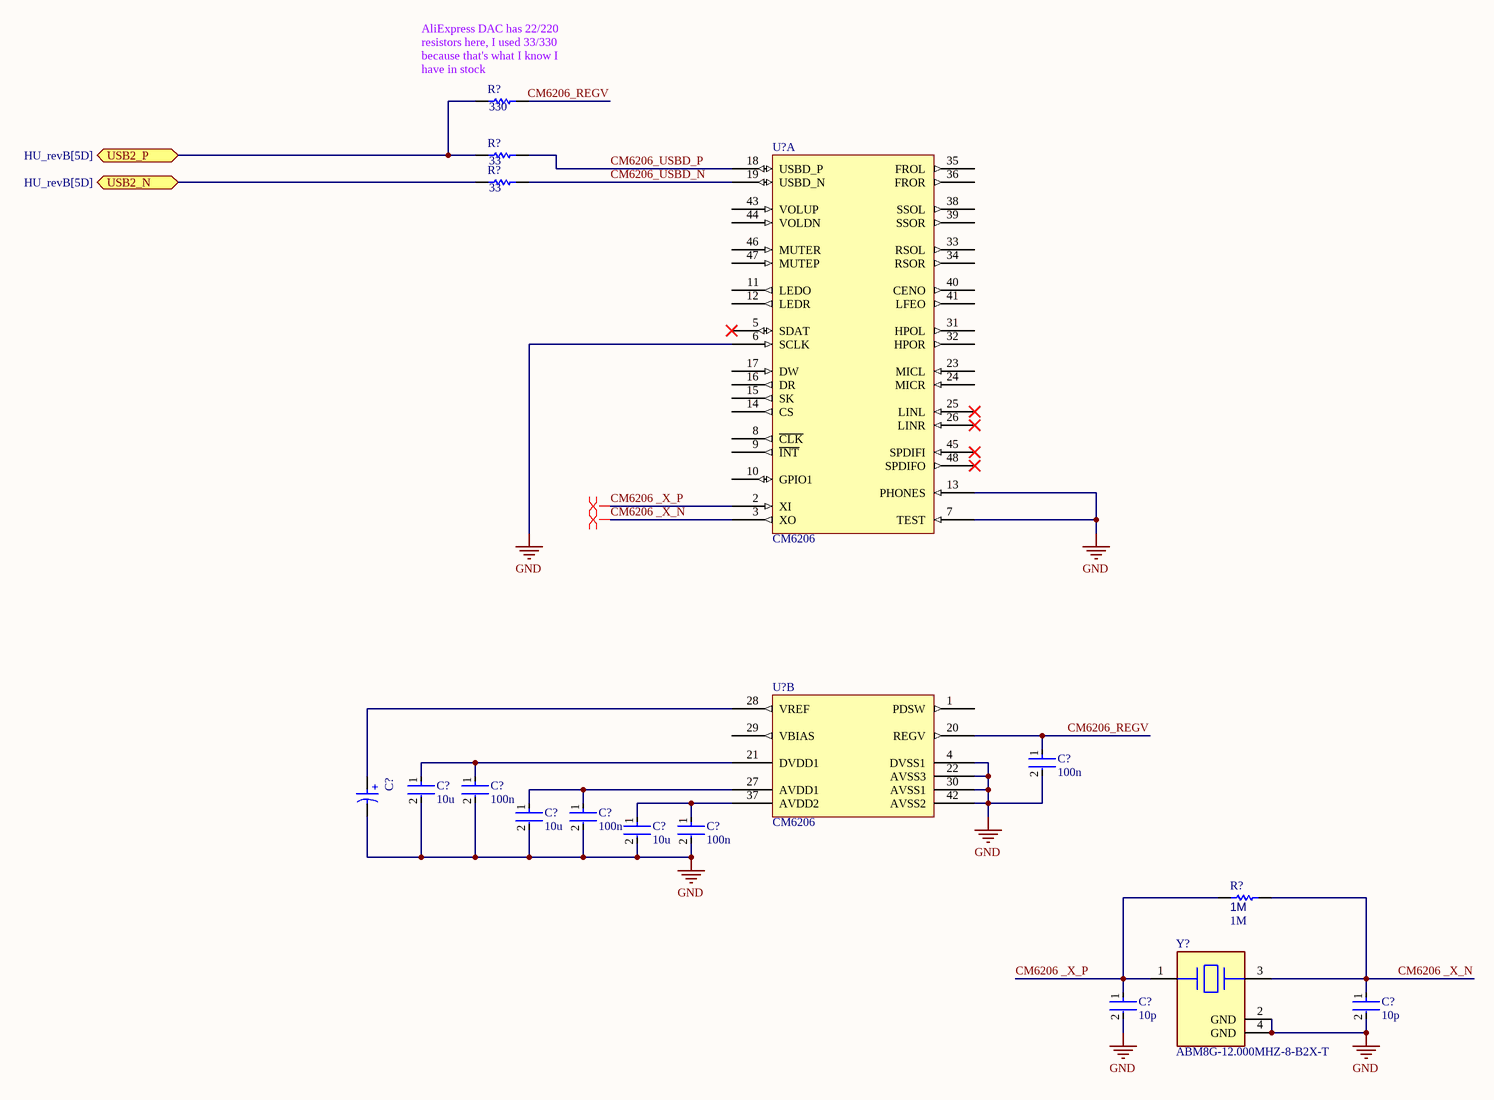
[diagram p5: CM6206_PINOUT.SchDoc]

### Parts
(Parts that share a designator on the sheet are numbered #1, #2 ... from top to bottom, then left to right.)
C?#1  100n  [FP-0402-L_1_0_0_05-W_0_5-IPC_A]
C?#2  875105242010  [WCAP-PSLP_D5H5.5]  (value not drawn)
C?#3  10u  [FP-0402-L_1_0_0_05-W_0_5-IPC_A]
C?#4  100n  [FP-0402-L_1_0_0_05-W_0_5-IPC_A]
C?#5  10u  [FP-0402-L_1_0_0_05-W_0_5-IPC_A]
C?#6  100n  [FP-0402-L_1_0_0_05-W_0_5-IPC_A]
C?#7  10u  [FP-0402-L_1_0_0_05-W_0_5-IPC_A]
C?#8  100n  [FP-0402-L_1_0_0_05-W_0_5-IPC_A]
C?#9  10p  [FP-0402-L_1_0_0_05-W_0_5-IPC_A]
C?#10  10p  [FP-0402-L_1_0_0_05-W_0_5-IPC_A]
R?#1  330  [R0603B]
R?#2  33  [R0603B]
R?#3  33  [R0603B]
R?#4  1M  [R0603B]
U?#1  CM6206  [CQFP50P900X900X160-48N]  (part A of 2)
U?#2  CM6206  [CQFP50P900X900X160-48N]  (part B of 2)
Y?  ABM8G-12.000MHZ-8-B2X-T  [FP-ABM8G-MFG]

### Ports
USB2_N (bidir, see HU_revB[5D]), USB2_P (bidir, see HU_revB[5D])

### Nets
GND: C?#1.2 C?#2.2(N) C?#3.2 C?#4.2 C?#5.2 C?#6.2 C?#7.2 C?#8.2 C?#9.2 C?#10.2 U?#1.6(SCLK) U?#1.7(TEST) U?#1.13(PHONES) U?#2.4(DVSS1) U?#2.22(AVSS3) U?#2.30(AVSS1) U?#2.42(AVSS2) Y?.2(GND) Y?.4(GND)
CM6206 _X_N: C?#10.1 R?#4.1 U?#1.3(XO) Y?.3
CM6206 _X_P: C?#9.1 R?#4.2 U?#1.2(XI) Y?.1
CM6206_REGV: C?#1.1 R?#1.1 U?#2.20(REGV)
CM6206_USBD_N: R?#3.1 U?#1.19(USBD_N)
CM6206_USBD_P: R?#2.1 U?#1.18(USBD_P)
NetC46_1: R?#1.2 R?#2.2 ; port USB2_P
NetC48_1: R?#3.2 ; port USB2_N
NetC?#2_1: C?#2.1(P) U?#2.28(VREF)
NetC?#3_1: C?#3.1 C?#4.1 U?#2.21(DVDD1)
NetC?#5_1: C?#5.1 C?#6.1 U?#2.27(AVDD1)
NetC?#7_1: C?#7.1 C?#8.1 U?#2.37(AVDD2)

Not connected (* = marked no-connect by the designer): U?#1 5(SDAT)* 8(~{CLK}) 9(~{INT}) 10(GPIO1) 11(LEDO) 12(LEDR) 14(CS) 15(SK) 16(DR) 17(DW) 23(MICL) 24(MICR) 25(LINL)* 26(LINR)* 31(HPOL) 32(HPOR) 33(RSOL) 34(RSOR) 35(FROL) 36(FROR) 38(SSOL) 39(SSOR) 40(CENO) 41(LFEO) 43(VOLUP) 44(VOLDN) 45(SPDIFI)* 46(MUTER) 47(MUTEP) 48(SPDIFO)*; U?#2 1(PDSW) 29(VBIAS)

### Layout directives
differential pair: CM6206 _X_N, CM6206 _X_P

### Notes on the sheet
- (near R?#1) AliExpress DAC has 22/220 resistors here, I used 33/330 because that's what I know I have in stock
- (in symbol CMP-207835-000001-3) +

### Library data of the parts
C?#1 C?#3-C?#10 = CMP-001-00058-1: as C1 on sheet HU_revB; Min Operating Temperature: -55°C; Mounting Technology: Surface Mount; Pins: 2; Case/Package: 0402; RoHS Compliant: Yes; Max Operating Temperature: 85°C
C?#2 = CMP-207835-000001-3: WCAP-PSLP Radial Can - SMD Aluminum Polymer Capacitor 0.197Dia 5.00mm ±20% 100muF 10V; Capacitance: 100µF; Leakage Current: 300µA; ESR (Equivalent Series Resistance): 30mΩ; Life (Hours): 2000hours; Polarity: Polar; Pitch: 5.3mm; Ripple Current: 1.97A; Dissipation Factor: 8%; Material: Polymer; Height: 5.5mm; Min Operating Temperature: -55°C; Max Operating Temperature: 105°C; Voltage Rating: 10V; Packaging: Tape & Reel (TR); RoHS: Compliant; Tolerance: 20%; REACH SVHC: Unknown; Length: 5.5mm; Mount: Surface Mount; Voltage Rating (DC): 10V; Diameter: 5mm; Height - Seated (Max): 5.5118mm; Case/Package: Radial
R?#1-R?#3 = CMP-009-00002-14: Resistor; Value: 220
R?#4 = CMP-009-00002-14: Resistor; Value: 1M
U?#1 U?#2 = CMP-015-00016-2: Highly Integrated USB Audio I/O Controller
Y? = CMP-27762-015492-1: Crystal 12MHz ±20ppm (Tol) ±20ppm (Stability) 8pF FUND 120Ω 4-Pin SMD T/R